# EAGLE design Titan_6L_v1p2 (EAGLE 9.6.2)
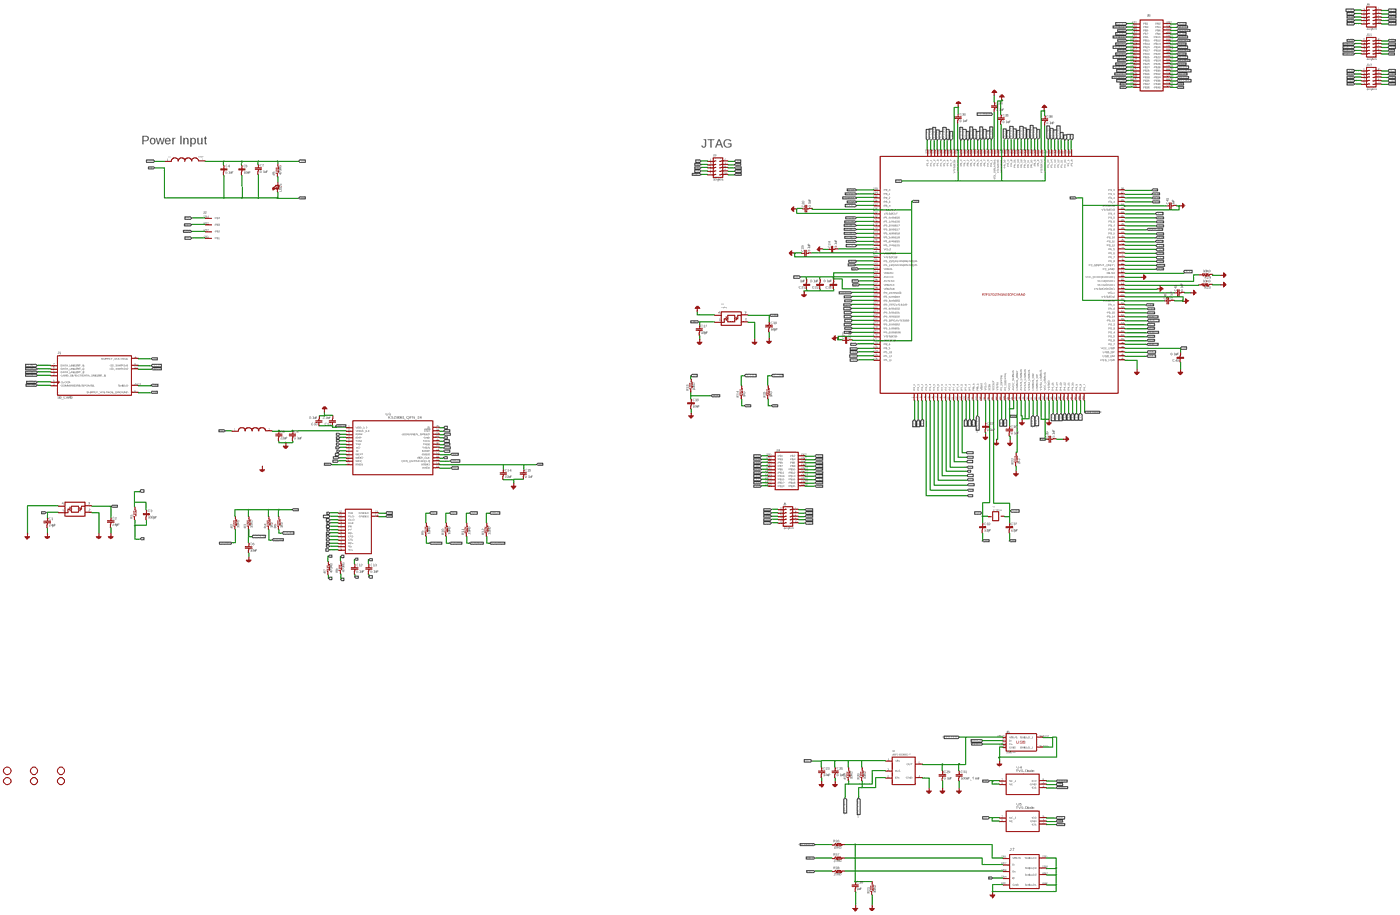
[diagram p0: schematic, sheet 1, overview]
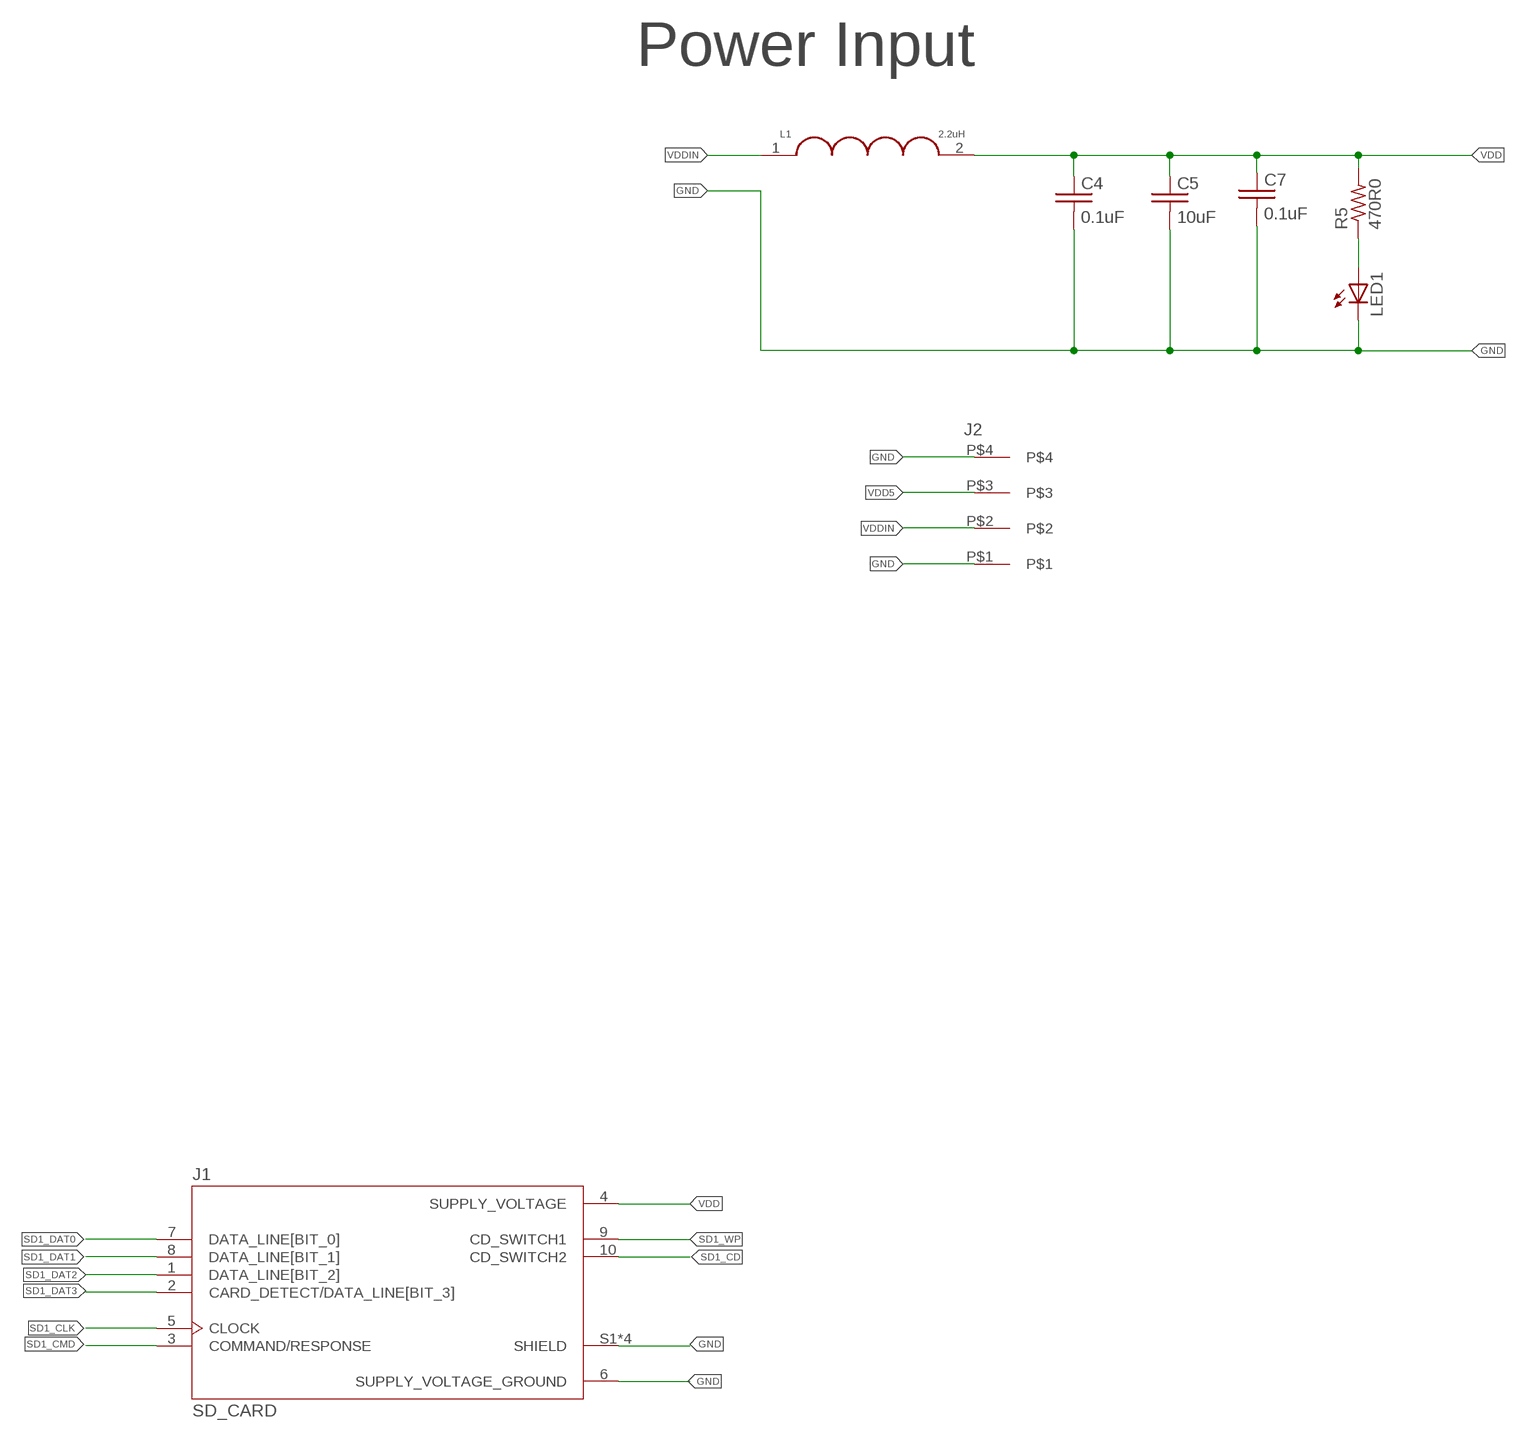
[diagram p1: schematic, sheet 1, part 1 of 5]
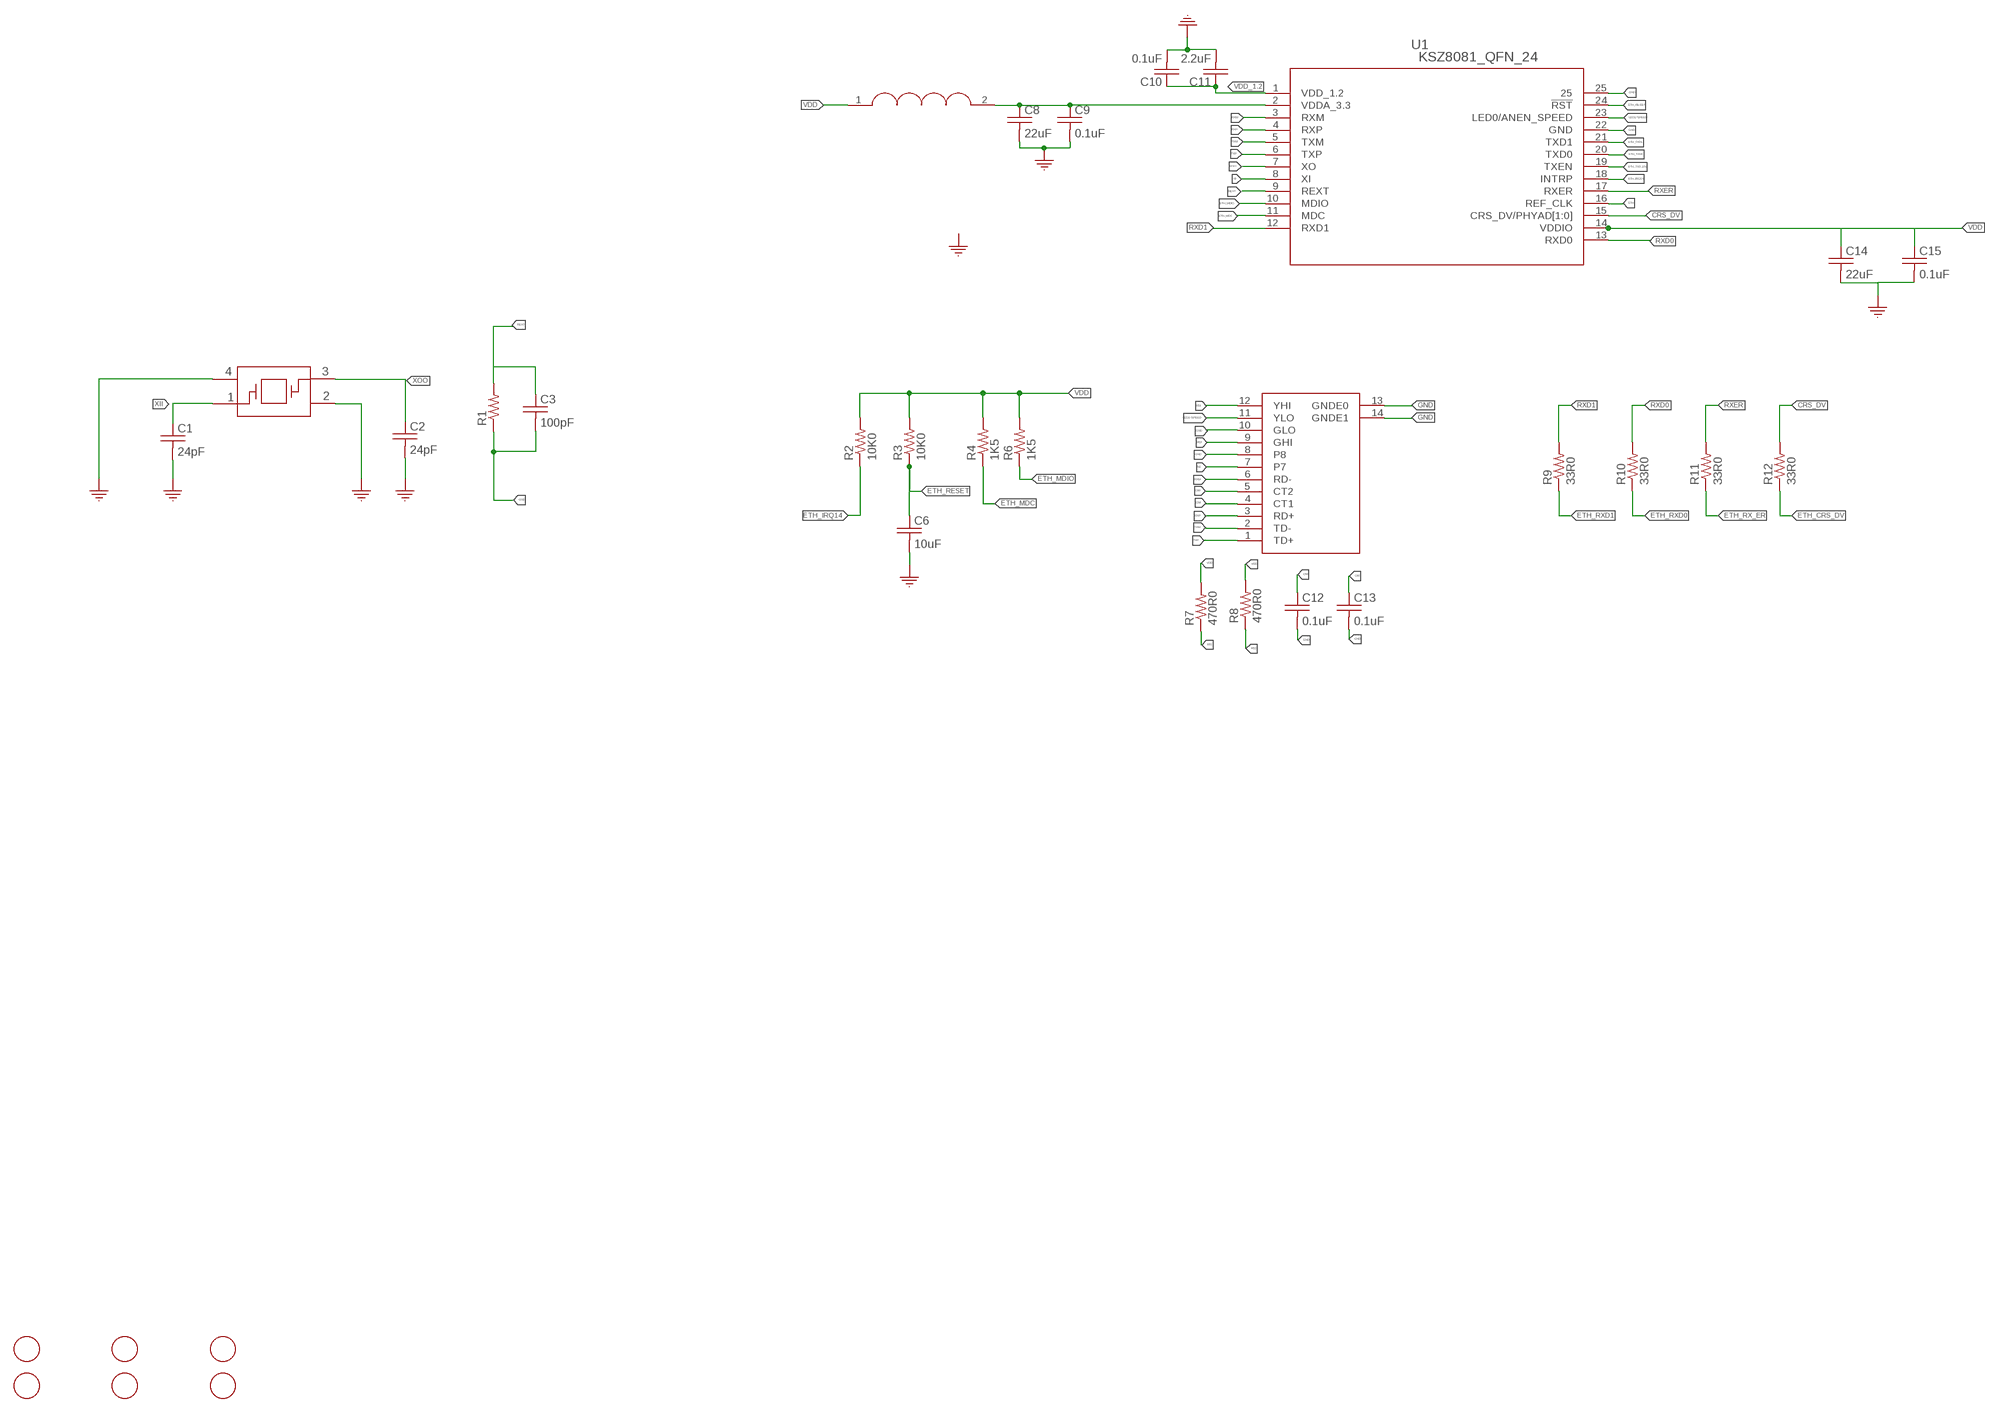
[diagram p2: schematic, sheet 1, part 2 of 5]
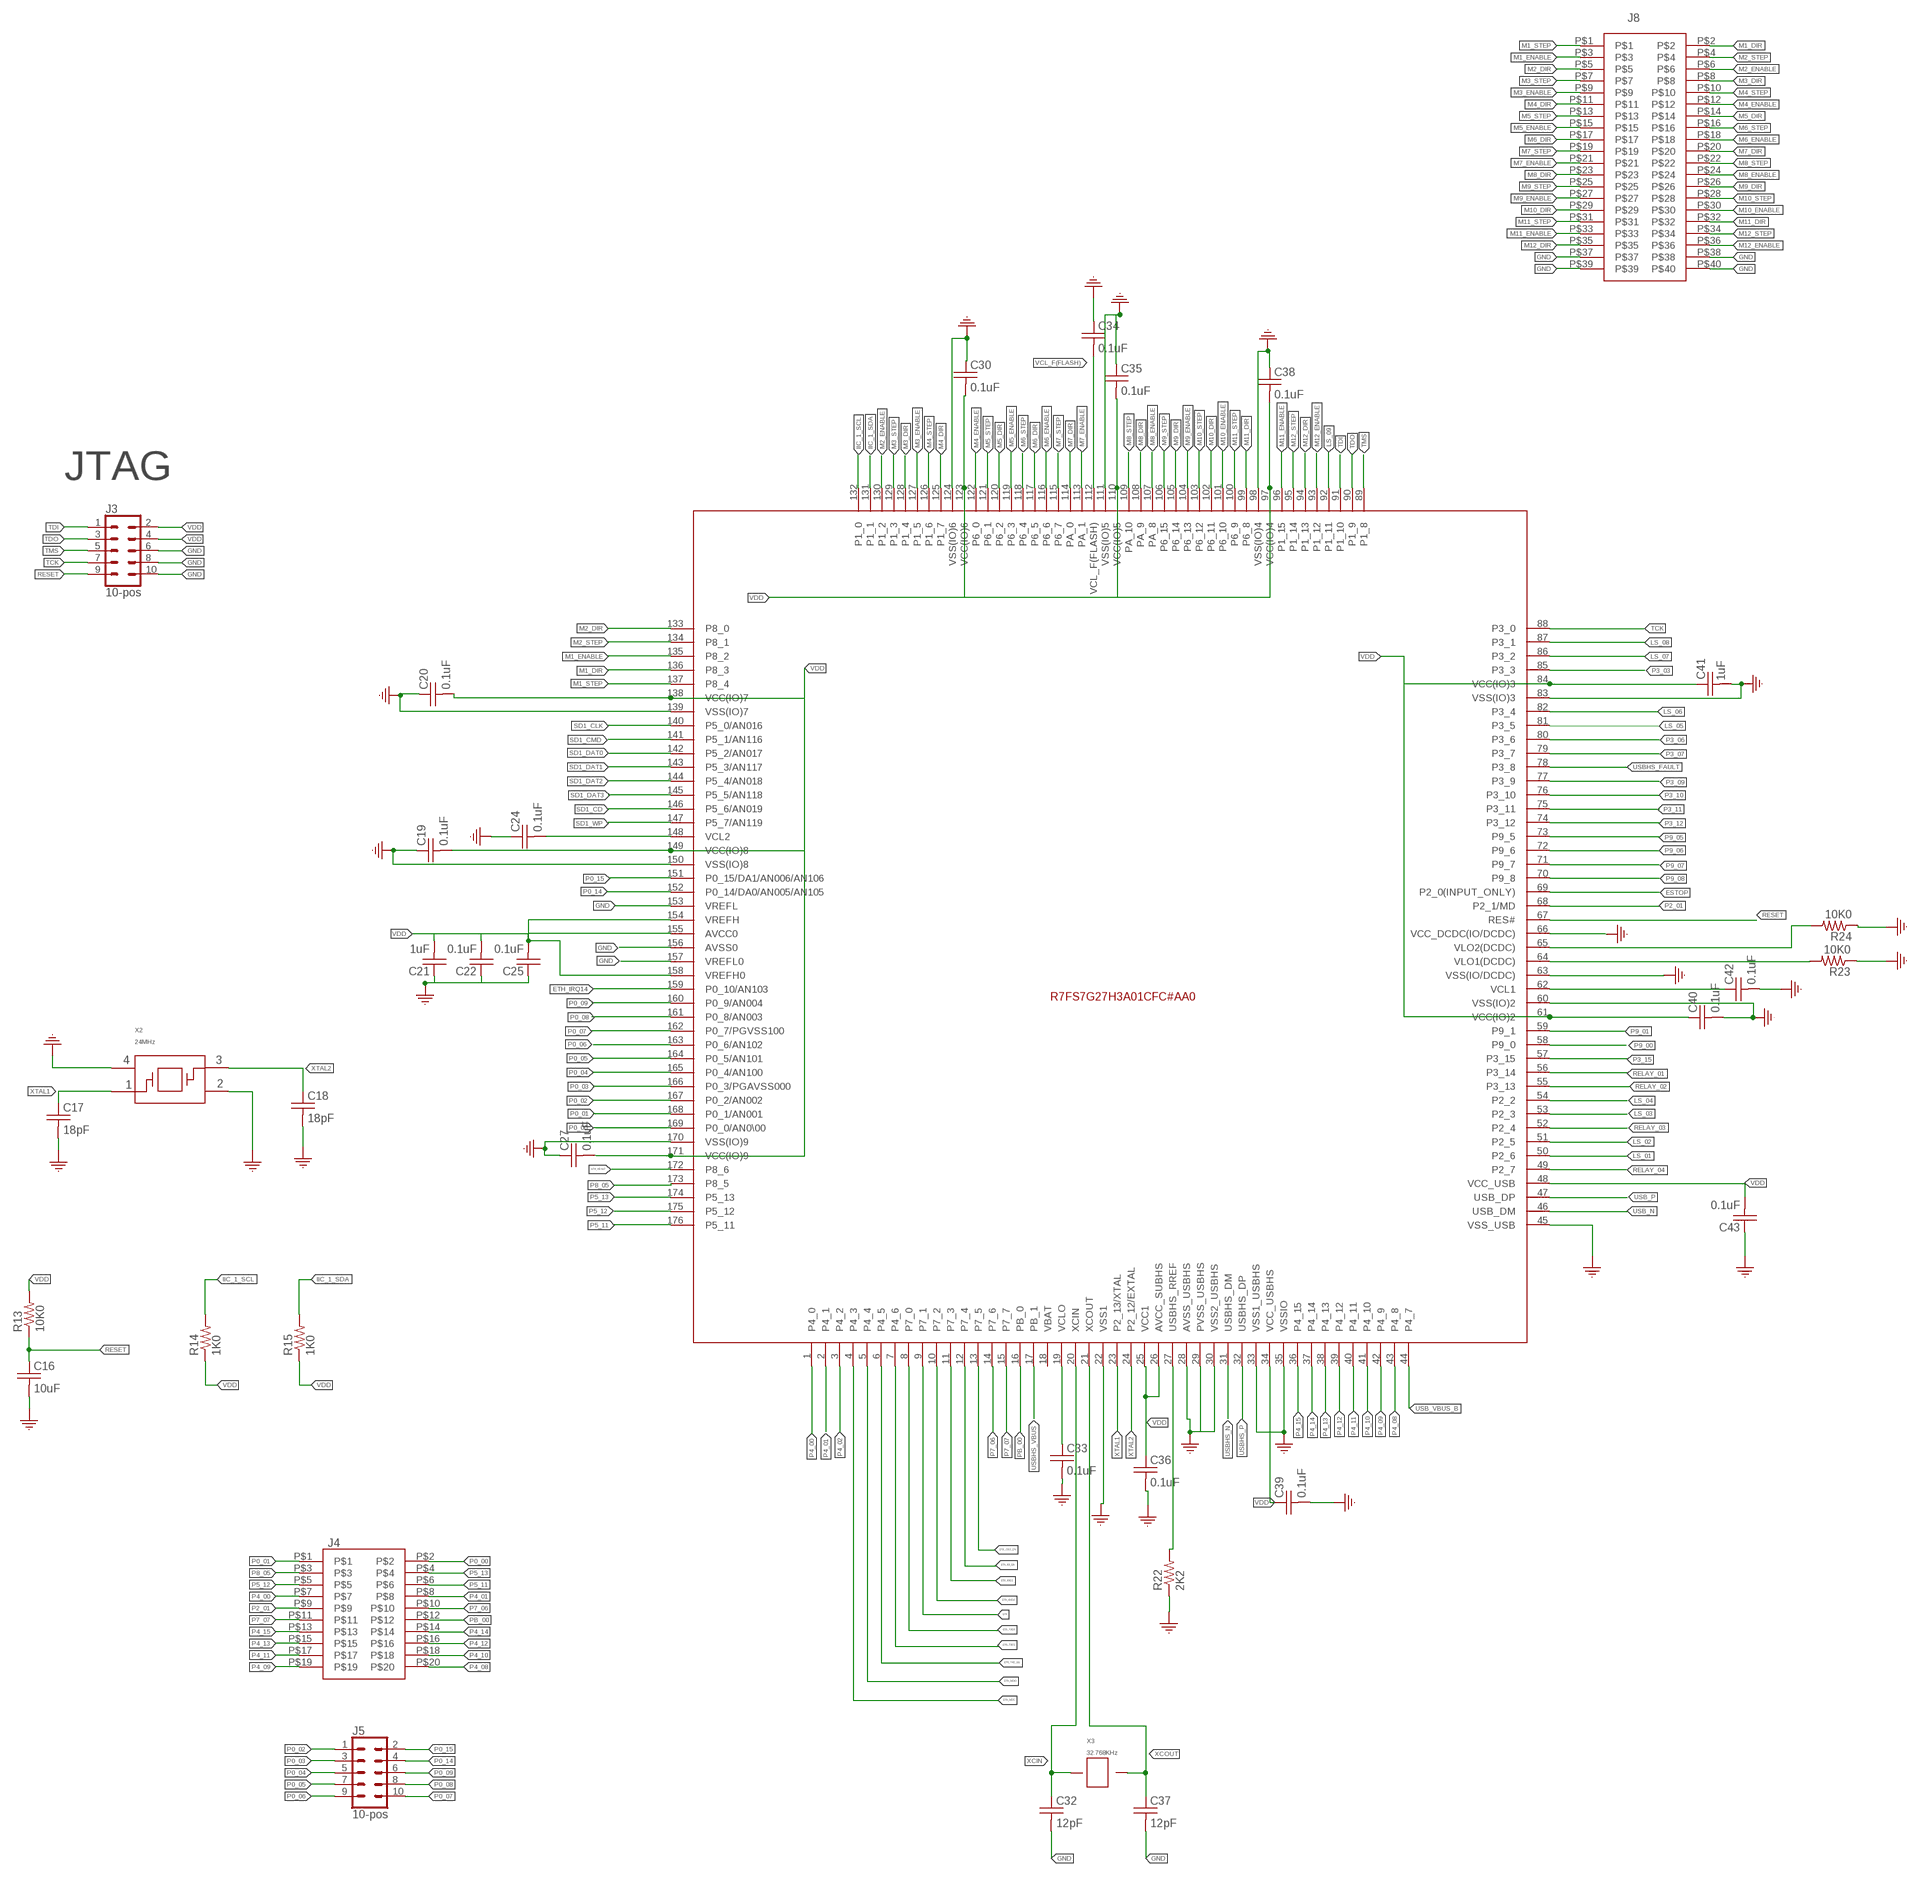
[diagram p3: schematic, sheet 1, part 3 of 5]
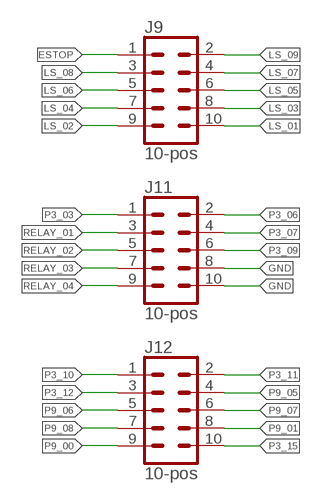
[diagram p4: schematic, sheet 1, part 4 of 5]
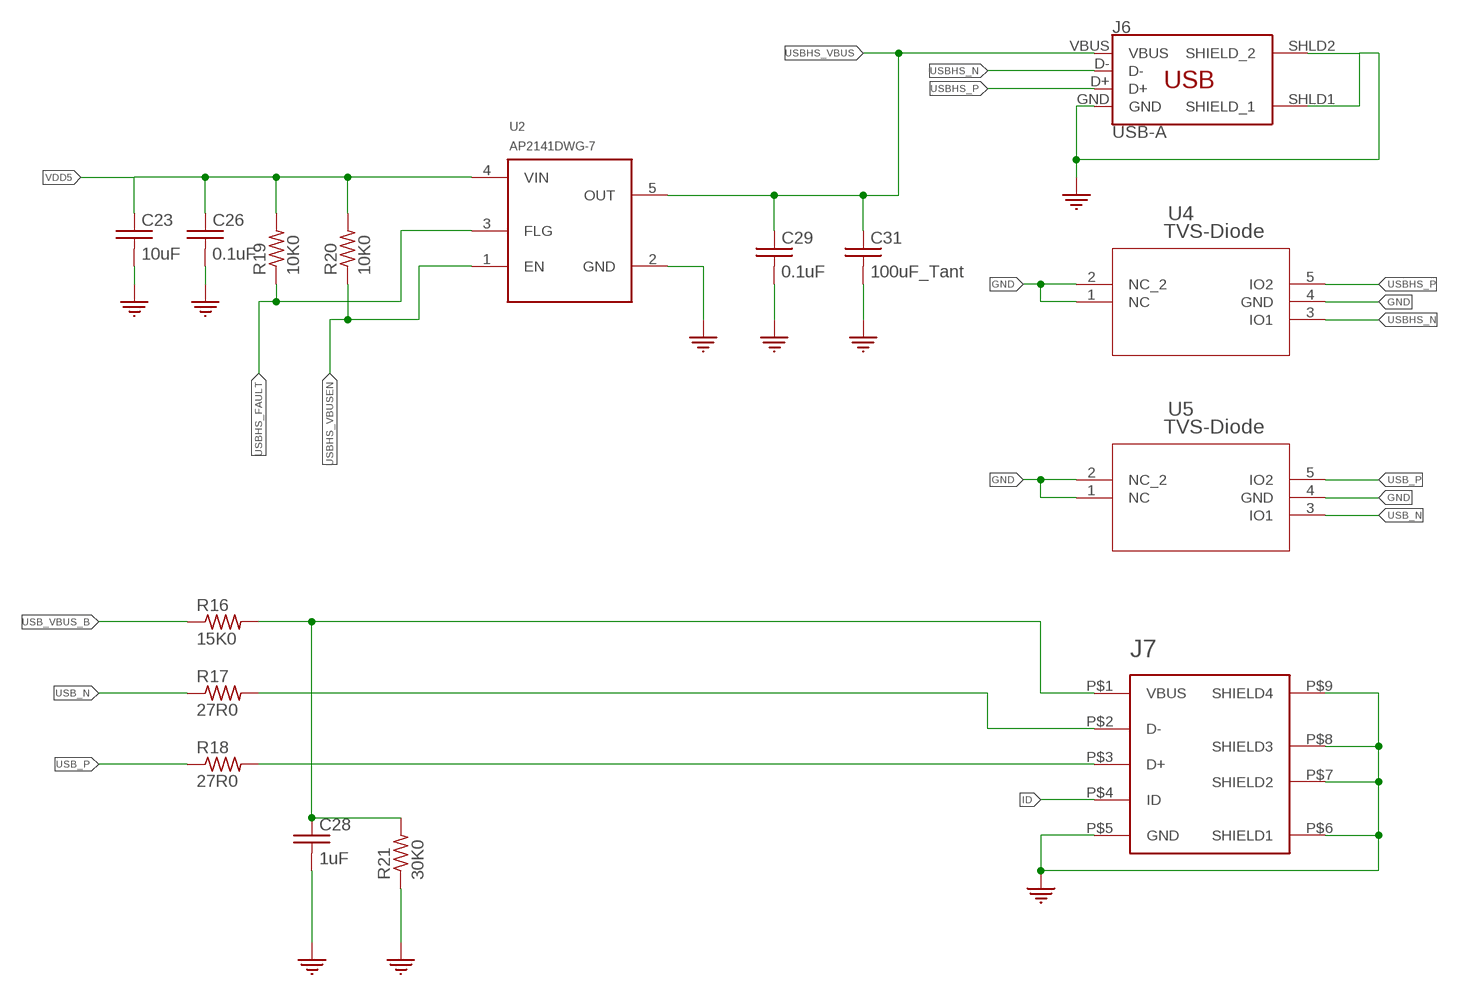
[diagram p5: schematic, sheet 1, part 5 of 5]

## Parts
AFID1  FIDUCIAL_1MM  [FIDUCIAL_1MM]
AFID2  FIDUCIAL_1MM  [FIDUCIAL_1MM]
AFID3  FIDUCIAL_1MM  [FIDUCIAL_1MM]
AFID4  FIDUCIAL_1MM  [FIDUCIAL_1MM]
AFID5  FIDUCIAL_1MM  [FIDUCIAL_1MM]
AFID6  FIDUCIAL_1MM  [FIDUCIAL_1MM]
C1  24pF  C_0402_24PF  [0402]
C2  24pF  C_0402_24PF  [0402]
C3  100pF  C_0402_100PF  [0402]
C4  0.1uF  C_0402_0.1UF  [0402]
C5  10uF  C_0402_10UF  [0402]
C6  10uF  C_0402_10UF  [0402]
C7  0.1uF  C_0402_0.1UF  [0402]
C8  22uF  C_0402_22UF  [0402]
C9  0.1uF  C_0402_0.1UF  [0402]
C10  0.1uF  C_0402_0.1UF  [0402]
C11  2.2uF  C_0402_2.2UF  [0402]
C12  0.1uF  C_0402_0.1UF  [0402]
C13  0.1uF  C_0402_0.1UF  [0402]
C14  22uF  C_0402_22UF  [0402]
C15  0.1uF  C_0402_0.1UF  [0402]
C16  10uF  C_0402_10UF  [0402]
C17  18pF  C_0402_18PF  [0402]
C18  18pF  C_0402_18PF  [0402]
C19  0.1uF  C_0402_0.1UF  [0402]
C20  0.1uF  C_0402_0.1UF  [0402]
C21  1uF  C_0402_1UF  [0402]
C22  0.1uF  C_0402_0.1UF  [0402]
C23  10uF  C_0402_10UF  [0402]
C24  0.1uF  C_0402_0.1UF  [0402]
C25  0.1uF  C_0402_0.1UF  [0402]
C26  0.1uF  C_0402_0.1UF  [0402]
C27  0.1uF  C_0402_0.1UF  [0402]
C28  1uF  C_0402_1UF  [0402]
C29  0.1uF  C_0402_0.1UF  [0402]
C30  0.1uF  C_0402_0.1UF  [0402]
C31  100uF_Tant  C_1210_100UF_TANT  [C1210]
C32  12pF  C_0402_12PF  [0402]
C33  0.1uF  C_0402_0.1UF  [0402]
C34  0.1uF  C_0402_0.1UF  [0402]
C35  0.1uF  C_0402_0.1UF  [0402]
C36  0.1uF  C_0402_0.1UF  [0402]
C37  12pF  C_0402_12PF  [0402]
C38  0.1uF  C_0402_0.1UF  [0402]
C39  0.1uF  C_0402_0.1UF  [0402]
C40  0.1uF  C_0402_0.1UF  [0402]
C41  1uF  C_0402_1UF  [0402]
C42  0.1uF  C_0402_0.1UF  [0402]
C43  0.1uF  C_0402_0.1UF  [0402]
FB1  FB2_603  FB_0603_120_OHM0603  [0603]
J1  SD_CARD  SD_CARD_1140084168  [SD_CARD]
J2  4-pos  3.81MM_1_X_4_RT_ANGLE_PLUG_HEADER  [1X4_3.81MM_PITCH]
J3  10-pos  CONN_05X2_RAPTH  [2X5]
J4  20-pos  2_X_10_HEADER_GENERIC  [2_X_10_.1_INCH]
J5  10-pos  CONN_05X2_RAPTH  [2X5]
J6  USB-A  USB_A  [USB_A_SMT]
J7  USB-B-Micro  USB_MICRO-B  [USB_MICRO-B]
J8  40-pos  HEADER_2_X_20_GENERIC  [HEADER_2_X_20_.1_INCH]
J9  10-pos  CONN_05X2_RAPTH  [2X5]
J11  10-pos  CONN_05X2_RAPTH  [2X5]
J12  10-pos  CONN_05X2_RAPTH  [2X5]
L1  2.2uH  INDUCTOR_1008_2.2_MH_1.3A  [1008]
LED1  Green  LED_0805_GREEN  [0805]
R1  6K49  R_0402_6K49  [0402]
R2  10K0  R_0402_10K0  [0402]
R3  10K0  R_0402_10K0  [0402]
R4  1K5  R_0402_1K5  [0402]
R5  470R0  R_0402_470R0  [0402]
R6  1K5  R_0402_1K5  [0402]
R7  470R0  R_0402_470R0  [0402]
R8  470R0  R_0402_470R0  [0402]
R9  33R0  R_0402_33R0  [0402]
R10  33R0  R_0402_33R0  [0402]
R11  33R0  R_0402_33R0  [0402]
R12  33R0  R_0402_33R0  [0402]
R13  10K0  R_0402_10K0  [0402]
R14  1K0  R_0402_1K0  [0402]
R15  1K0  R_0402_1K0  [0402]
R16  15K0  R_0402_15K0  [0402]
R17  27R0  R_0402_27R0  [0402]
R18  27R0  R_0402_27R0  [0402]
R19  10K0  R_0402_10K0  [0402]
R20  10K0  R_0402_10K0  [0402]
R21  30K0  R_0402_30K0  [0402]
R22  2K2  R_0402_2K2  [0402]
R23  10K0  R_0402_10K0  [0402]
R24  10K0  R_0402_10K0  [0402]
RJ1  RJ45  RJ45_WITH_ELEC  [RJ45_TH_ELEC]
U1  KSZ8081_QFN_24  KSZ8081RNACAQFN-24-M  [QFN-24-M]
U2  AP2151DWG-7  [SOT-23-5]
U3  S7G2LQFP176  RENESAS_S7G2_X_176  [LQFP176_24X24]
U4  TVS-Diode  TPD2E2U06DRLR  [DRL5]
U5  TVS-Diode  TPD2E2U06DRLR  [DRL5]
X1  25MHz  XTAL_25_MHZ  [SMD_3225]
X2  24MHz  XTAL_24_MHZ  [SMD_3225]
X3  32.768KHz  XTAL_32.768KHZ  [SMD_X_2_PADS]

## Nets
C58: C12.P$1 RJ1.4(CT1)
C60: C13.P$1 RJ1.5(CT2)
CRS_DV: R12.P$2 U1.15(CRS_DV/PHYAD[1:0])
D+: J7.P$3(D+) R18.P$2
D-: J7.P$2(D-) R17.P$2
ESTOP: J9.1 U3.69(P2_0(INPUT_ONLY))
ETH: U1.16(REF_CLK) U3.9(P7_1)
ETH_CRS_DV: R12.P$1 U3.13(P7_5)
ETH_IRQ14: R2.P$1 U1.18(INTRP) U3.159(P0_10/AN103)
ETH_MDC: R4.P$1 U1.11(MDC) U3.4(P4_3)
ETH_MDIO: R6.P$1 U1.10(MDIO) U3.5(P4_4)
ETH_RESET: C6.P$1 R3.P$1 U1.24(!RST) U3.172(P8_6)
ETH_RX_ER: R11.P$1 U3.12(P7_4)
ETH_RXD0: R10.P$1 U3.10(P7_2)
ETH_RXD1: R9.P$1 U3.11(P7_3)
ETH_TXD0: U1.20(TXD0) U3.8(P7_0)
ETH_TXD1: U1.21(TXD1) U3.7(P4_6)
ETH_TXD_EN: U1.19(TXEN) U3.6(P4_5)
GND: C1.P$2 C2.P$2 C3.P$2 C4.P$2 C5.P$2 C6.P$2 C7.P$2 C8.P$2 C9.P$2 C10.P$2 C11.P$2 C12.P$2 C13.P$2 C14.P$2 C15.P$2 C16.P$2 C17.P$2 C18.P$2 C19.P$1 C20.P$1 C21.P$1 C22.P$1 C23.P$2 C24.P$1 C25.P$1 C26.P$2 C27.P$1 C28.P$2 C29.P$2 C30.P$1 C31.2 C32.P$2 C33.P$2 C34.P$1 C35.P$1 C36.P$2 C37.P$2 C38.P$1 C39.P$2 C40.P$2 C41.P$2 C42.P$2 C43.P$1 J1.6(SUPPLY_VOLTAGE_GROUND) J1.S1(SHIELD) J1.S2(SHIELD) J1.S3(SHIELD) J1.S4(SHIELD) J2.P$1 J2.P$4 J3.6 J3.8 J3.10 J6.GND J6.SHLD1(SHIELD_1) J6.SHLD2(SHIELD_2) J7.P$5(GND) J7.P$6(SHIELD1) J7.P$7(SHIELD2) J7.P$8(SHIELD3) J7.P$9(SHIELD4) J8.P$37 J8.P$38 J8.P$39 J8.P$40 J11.8 J11.10 LED1.2(C) R1.P$1 R21.P$1 R22.P$1 R23.P$1 R24.P$1 RJ1.8 RJ1.10(GLO) RJ1.13(GNDE0) RJ1.14(GNDE1) U1.22(GND) U1.25 U2.2(GND) U3.22(VSS1) U3.28(AVSS_USBHS) U3.29(PVSS_USBHS) U3.30(VSS2_USBHS) U3.33(VSS1_USBHS) U3.35(VSSIO) U3.45(VSS_USB) U3.60(VSS(IO)2) U3.63(VSS(IO/DCDC)) U3.66(VCC_DCDC(IO/DCDC)) U3.83(VSS(IO)3) U3.98(VSS(IO)4) U3.111(VSS(IO)5) U3.124(VSS(IO)6) U3.139(VSS(IO)7) U3.150(VSS(IO)8) U3.153(VREFL) U3.156(AVSS0) U3.157(VREFL0) U3.170(VSS(IO)9) U4.1(NC) U4.2(NC_2) U4.4(GND) U5.1(NC) U5.2(NC_2) U5.4(GND) X1.2 X1.4 X2.2 X2.4
ID: J7.P$4(ID)
IIC_1_SCL: R14.P$2 U3.132(P1_0)
IIC_1_SDA: R15.P$2 U3.131(P1_1)
LED1/SPEED: RJ1.11(YLO) U1.23(LED0/ANEN_SPEED)
LS_01: J9.10 U3.50(P2_6)
LS_02: J9.9 U3.51(P2_5)
LS_03: J9.8 U3.53(P2_3)
LS_04: J9.7 U3.54(P2_2)
LS_05: J9.6 U3.81(P3_5)
LS_06: J9.5 U3.82(P3_4)
LS_07: J9.4 U3.86(P3_2)
LS_08: J9.3 U3.87(P3_1)
LS_09: J9.2 U3.92(P1_11)
M1_DIR: J8.P$2 U3.136(P8_3)
M1_ENABLE: J8.P$3 U3.135(P8_2)
M1_STEP: J8.P$1 U3.137(P8_4)
M2_DIR: J8.P$5 U3.133(P8_0)
M2_ENABLE: J8.P$6 U3.130(P1_2)
M2_STEP: J8.P$4 U3.134(P8_1)
M3_DIR: J8.P$8 U3.128(P1_4)
M3_ENABLE: J8.P$9 U3.127(P1_5)
M3_STEP: J8.P$7 U3.129(P1_3)
M4_DIR: J8.P$11 U3.125(P1_7)
M4_ENABLE: J8.P$12 U3.122(P6_0)
M4_STEP: J8.P$10 U3.126(P1_6)
M5_DIR: J8.P$14 U3.120(P6_2)
M5_ENABLE: J8.P$15 U3.119(P6_3)
M5_STEP: J8.P$13 U3.121(P6_1)
M6_DIR: J8.P$17 U3.117(P6_5)
M6_ENABLE: J8.P$18 U3.116(P6_6)
M6_STEP: J8.P$16 U3.118(P6_4)
M7_DIR: J8.P$20 U3.114(PA_0)
M7_ENABLE: J8.P$21 U3.113(PA_1)
M7_STEP: J8.P$19 U3.115(P6_7)
M8_DIR: J8.P$23 U3.108(PA_9)
M8_ENABLE: J8.P$24 U3.107(PA_8)
M8_STEP: J8.P$22 U3.109(PA_10)
M9_DIR: J8.P$26 U3.105(P6_14)
M9_ENABLE: J8.P$27 U3.104(P6_13)
M9_STEP: J8.P$25 U3.106(P6_15)
M10_DIR: J8.P$29 U3.102(P6_11)
M10_ENABLE: J8.P$30 U3.101(P6_10)
M10_STEP: J8.P$28 U3.103(P6_12)
M11_DIR: J8.P$32 U3.99(P6_8)
M11_ENABLE: J8.P$33 U3.96(P1_15)
M11_STEP: J8.P$31 U3.100(P6_9)
M12_DIR: J8.P$35 U3.94(P1_13)
M12_ENABLE: J8.P$36 U3.93(P1_12)
M12_STEP: J8.P$34 U3.95(P1_14)
N$1: C24.P$2 U3.148(VCL2)
N$3: LED1.1(A) R5.P$1
N$4: C33.P$1 U3.19(VCLO)
N$5: C42.P$1 U3.62(VCL1)
N$6: R23.P$2 U3.64(VLO1(DCDC))
N$7: R24.P$2 U3.65(VLO2(DCDC))
N$8: R22.P$2 U3.27(USBHS_RREF)
NC: RJ1.7
P0_00: J4.P$2 U3.169(P0_0/AN0\00)
P0_01: J4.P$1 U3.168(P0_1/AN001)
P0_02: J5.1 U3.167(P0_2/AN002)
P0_03: J5.3 U3.166(P0_3/PGAVSS000)
P0_04: J5.5 U3.165(P0_4/AN100)
P0_05: J5.7 U3.164(P0_5/AN101)
P0_06: J5.9 U3.163(P0_6/AN102)
P0_07: J5.10 U3.162(P0_7/PGVSS100)
P0_08: J5.8 U3.161(P0_8/AN003)
P0_09: J5.6 U3.160(P0_9/AN004)
P0_14: J5.4 U3.152(P0_14/DA0/AN005/AN105)
P0_15: J5.2 U3.151(P0_15/DA1/AN006/AN106)
P2_01: J4.P$9 U3.68(P2_1/MD)
P3_03: J11.1 U3.85(P3_3)
P3_06: J11.2 U3.80(P3_6)
P3_07: J11.4 U3.79(P3_7)
P3_09: J11.6 U3.77(P3_9)
P3_10: J12.1 U3.76(P3_10)
P3_11: J12.2 U3.75(P3_11)
P3_12: J12.3 U3.74(P3_12)
P3_15: J12.10 U3.57(P3_15)
P4_00: J4.P$7 U3.1(P4_0)
P4_01: J4.P$8 U3.2(P4_1)
P4_02: U3.3(P4_2)
P4_08: J4.P$20 U3.43(P4_8)
P4_09: J4.P$19 U3.42(P4_9)
P4_10: J4.P$18 U3.41(P4_10)
P4_11: J4.P$17 U3.40(P4_11)
P4_12: J4.P$16 U3.39(P4_12)
P4_13: J4.P$15 U3.38(P4_13)
P4_14: J4.P$14 U3.37(P4_14)
P4_15: J4.P$13 U3.36(P4_15)
P5_11: J4.P$6 U3.176(P5_11)
P5_12: J4.P$5 U3.175(P5_12)
P5_13: J4.P$4 U3.174(P5_13)
P7_06: J4.P$10 U3.14(P7_6)
P7_07: J4.P$11 U3.15(P7_7)
P8_05: J4.P$3 U3.173(P8_5)
P9_00: J12.9 U3.58(P9_0)
P9_01: J12.8 U3.59(P9_1)
P9_05: J12.4 U3.73(P9_5)
P9_06: J12.5 U3.72(P9_6)
P9_07: J12.6 U3.71(P9_7)
P9_08: J12.7 U3.70(P9_8)
PB_00: J4.P$12 U3.16(PB_0)
R51: R7.P$1 RJ1.12(YHI)
R52: R8.P$1 RJ1.9(GHI)
RELAY_01: J11.3 U3.56(P3_14)
RELAY_02: J11.5 U3.55(P3_13)
RELAY_03: J11.7 U3.52(P2_4)
RELAY_04: J11.9 U3.49(P2_7)
RESET: C16.P$1 J3.9 R13.P$1 U3.67(RES#)
REXT: C3.P$1 R1.P$2 U1.9(REXT)
RXD0: R10.P$2 U1.13(RXD0)
RXD1: R9.P$2 U1.12(RXD1)
RXER: R11.P$2 U1.17(RXER)
RXM: RJ1.6(RD-) U1.3(RXM)
RXP: RJ1.3(RD+) U1.4(RXP)
SD1_CD: J1.10(CD_SWITCH2) U3.146(P5_6/AN019)
SD1_CLK: J1.5(CLOCK) U3.140(P5_0/AN016)
SD1_CMD: J1.3(COMMAND/RESPONSE) U3.141(P5_1/AN116)
SD1_DAT0: J1.7(DATA_LINE[BIT_0]) U3.142(P5_2/AN017)
SD1_DAT1: J1.8(DATA_LINE[BIT_1]) U3.143(P5_3/AN117)
SD1_DAT2: J1.1(DATA_LINE[BIT_2]) U3.144(P5_4/AN018)
SD1_DAT3: J1.2(CARD_DETECT/DATA_LINE[BIT_3]) U3.145(P5_5/AN118)
SD1_WP: J1.9(CD_SWITCH1) U3.147(P5_7/AN119)
TCK: J3.7 U3.88(P3_0)
TDI: J3.1 U3.91(P1_10)
TDO: J3.3 U3.90(P1_9)
TMS: J3.5 U3.89(P1_8)
TXM: RJ1.2(TD-) U1.5(TXM)
TXP: RJ1.1(TD+) U1.6(TXP)
USB_N: R17.P$1 U3.46(USB_DM) U5.3(IO1)
USB_P: R18.P$1 U3.47(USB_DP) U5.5(IO2)
USB_VBUS_B: R16.P$1 U3.44(P4_7)
USBHS_FAULT: R19.P$1 U2.3(FLG) U3.78(P3_8)
USBHS_N: J6.D- U3.31(USBHS_DM) U4.3(IO1)
USBHS_P: J6.D+ U3.32(USBHS_DP) U4.5(IO2)
USBHS_VBUS: C29.P$1 C31.1 J6.VBUS U2.5(OUT) U3.17(PB_1)
USBHS_VBUSEN: R20.P$1 U2.1(EN)
VBUS: C28.P$1 J7.P$1(VBUS) R16.P$2 R21.P$2
VCL_F(FLASH): C34.P$2 U3.112(VCL_F(FLASH))
VDD: C4.P$1 C5.P$1 C7.P$1 C14.P$1 C15.P$1 C19.P$2 C20.P$2 C21.P$2 C22.P$2 C25.P$2 C27.P$2 C30.P$2 C35.P$2 C36.P$1 C38.P$2 C39.P$1 C40.P$1 C41.P$1 C43.P$2 FB1.1 J1.4(SUPPLY_VOLTAGE) J3.2 J3.4 L1.2 R2.P$2 R3.P$2 R4.P$2 R5.P$2 R6.P$2 R7.P$2 R8.P$2 R13.P$2 R14.P$1 R15.P$1 U1.14(VDDIO) U3.25(VCC1) U3.26(AVCC_SUBHS) U3.34(VCC_USBHS) U3.48(VCC_USB) U3.61(VCC(IO)2) U3.84(VCC(IO)3) U3.97(VCC(IO)4) U3.110(VCC(IO)5) U3.123(VCC(IO)6) U3.138(VCC(IO)7) U3.149(VCC(IO)8) U3.154(VREFH) U3.155(AVCC0) U3.158(VREFH0) U3.171(VCC(IO)9)
VDD5: C23.P$1 C26.P$1 J2.P$3 R19.P$2 R20.P$2 U2.4(VIN)
VDD_1.2: C10.P$1 C11.P$1 U1.1(VDD_1.2)
VDD_ENET1: C8.P$1 C9.P$1 FB1.2 U1.2(VDDA_3.3)
VDDIN: J2.P$2 L1.1
XCIN: C32.P$1 U3.20(XCIN) X3.P$1
XCOUT: C37.P$1 U3.21(XCOUT) X3.P$2
XII: C1.P$1 U1.8(XI) X1.1
XOO: C2.P$1 U1.7(XO) X1.3
XTAL1: C17.P$1 U3.23(P2_13/XTAL) X2.1
XTAL2: C18.P$1 U3.24(P2_12/EXTAL) X2.3
Unconnected: U3.18(VBAT)

## Notes on the sheet
- Power Input | JTAG

## Library data of the parts
AFID1-AFID6 = 3D_MIG_Controller:FIDUCIAL_1MM: For use by pick and place machines to calibrate the vision/machine, 1mm By microbuilder.eu
C1 C2 = 3D_MIG_Controller:C_0402_24PF; PARTNO: CC0402GRNPO9BN240
C3 = 3D_MIG_Controller:C_0402_100PF; PARTNO: CL05C101JB5NNNC
C4 C7 C9 C10 C12 C13 C15 C19 C20 C22 C24-C27 C29 C30 C33-C36 C38-C40 C42 C43 = 3D_MIG_Controller:C_0402_0.1UF; PARTNO: CL05F104ZO5NNNC
C5 C6 C16 C23 = 3D_MIG_Controller:C_0402_10UF; PARTNO: CL05A106MP8NUB8
C8 C14 = 3D_MIG_Controller:C_0402_22UF; PARTNO: CL05A226MQ5N6J8
C11 = 3D_MIG_Controller:C_0402_2.2UF; PARTNO: GRM155C81C225ME15D
C17 C18 = 3D_MIG_Controller:C_0402_18PF; PARTNO: UMK105CG180JV-F
C21 C28 C41 = 3D_MIG_Controller:C_0402_1UF; PARTNO: CL05A105KO5NNNC
C31 = 3D_MIG_Controller:C_1210_100UF_TANT; PARTNO: TLJT107M010R0900
C32 C37 = 3D_MIG_Controller:C_0402_12PF; PARTNO: CL05C120JB5NNNC
FB1 = 3D_MIG_Controller:FB_0603_120_OHM; PARTNO: BLM18PG121SN1D
J1 = 3D_MIG_Controller:SD_CARD_1140084168: Conn; IC Socket; Micro SD; Right Angle; PCB Mount; MicroSD Ser.:: 10 _8 + 2_ Position Card Connector Secure Digital - microSD™ Surface Mount, Right Angle Gold; MF: Amphenol ICC; PARTNO: 114-00841-68; VID: Digikey; VP: 114-00841-68-1-ND; VURL: https://www.digikey.ae/product-detail/en/amphenol-icc-commercial-products/114-00841-68/114-00841-68-1-ND/2187101?utm_source=snapeda&utm_medium=aggregator&utm_campaign=symbol
J2 = 3D_MIG_Controller:3.81MM_1_X_4_RT_ANGLE_PLUG_HEADER: 4 Position Terminal Block Header, Male Pins, Shrouded (4 Side) 0.150" (3.81mm) 90°, Right Angle - Through Hole; PARTNO: 691322310004
J3 J5 J9 J11 J12 = 3D_MIG_Controller:CONN_05X2_RA: Connector Header Through Hole, Right Angle 10 position 0.100" (2.54mm); PARTNO: PH2RA-10-UA
J4 = 3D_MIG_Controller:2_X_10_HEADER_GENERIC: CONN HEADER R/A 20POS 2.54MM, Straight, Right Angle; PARTNO: 67996-420HLF
J6 = 3D_MIG_Controller:USB_A: USB-A Connector Male and female variants, as well as PTH and SMT variants SparkFun Products: SparkFun XBee Explorer Dongle <https://www.sparkfun.com/products/11697> PTH Male SparkFun MicroView-USB Programmer <https://www.sparkfun.com/products/12924> SMT Male SparkFun USB Type A Female Breakout <https://www.sparkfun.com/products/12700> SMT Female; NOZZLE: CN400; PARTNO: 87583-3010RPALF
J7 = 3D_MIG_Controller:USB_MICRO-B; PARTNO: 10118192-0002LF
J8 = 3D_MIG_Controller:HEADER_2_X_20_GENERIC: CONN HEADER R/A 40POS 2.54MM; PARTNO: 61304021021
L1 = 3D_MIG_Controller:INDUCTOR_1008_2.2_MH_1.3A; PARTNO: LQM2HPN2R2MG0L
LED1 = 3D_MIG_Controller:LED_0805_GREEN: Green 570nm LED Indication - Discrete 2.2V 0805 (2012 Metric); PARTNO: LG R971-KN-1
R1 = 3D_MIG_Controller:R_0402_6K49; PARTNO: RMCF0402FT6K49
R2 R3 R13 R19 R20 R23 R24 = 3D_MIG_Controller:R_0402_10K0; PARTNO: RMCF0402JT10K0
R4 R6 = 3D_MIG_Controller:R_0402_1K5; PARTNO: RMCF0402JT1K50
R5 R7 R8 = 3D_MIG_Controller:R_0402_470R0; PARTNO: RMCF0402JT470R
R9-R12 = 3D_MIG_Controller:R_0402_33R0; PARTNO: RMCF0402JT33R0
R14 R15 = 3D_MIG_Controller:R_0402_1K0; PARTNO: CRG0402J1K0
R16 = 3D_MIG_Controller:R_0402_15K0; PARTNO: RMCF0402JT15K0
R17 R18 = 3D_MIG_Controller:R_0402_27R0; PARTNO: RMCF0402JT27R0
R21 = 3D_MIG_Controller:R_0402_30K0; PARTNO: RC0402JR-0730KL
R22 = 3D_MIG_Controller:R_0402_2K2; PARTNO: RMCF0402JT2K20
RJ1 = 3D_MIG_Controller:RJ45_WITH_ELEC; MAN: Shanghai YDS Tech; PARTNO: 13F-64GYD2PL2NL; VENDOR: lcsc.com
U1 = 3D_MIG_Controller:KSZ8081RNACA; PARTNO: KSZ8081RNACA; VENDOR: Micrel
U2 = 3D_MIG_Controller:AP2151DWG-7: Power Switch/Driver 1:1 P-Channel 500mA SOT-25; PARTNO: AP2151WG-7
U3 = 3D_MIG_Controller:RENESAS_S7G2_X_176; PARTNO: R7FS7G27H3A01CFC#AA0
U4 U5 = 3D_MIG_Controller:TPD2E2U06DRLR: TVS DIODE 5.5V 12.4V SOT5; PARTNO: TPD2E2U06DRLR
X1 = 3D_MIG_Controller:XTAL_25_MHZ; PARTNO: FA-238 25.0000MB-B3
X2 = 3D_MIG_Controller:XTAL_24_MHZ; PARTNO: FA-238 24.0000MB-C3
X3 = 3D_MIG_Controller:XTAL_32.768KHZ; PARTNO: ABS07-32.768KHZ-T

## Board
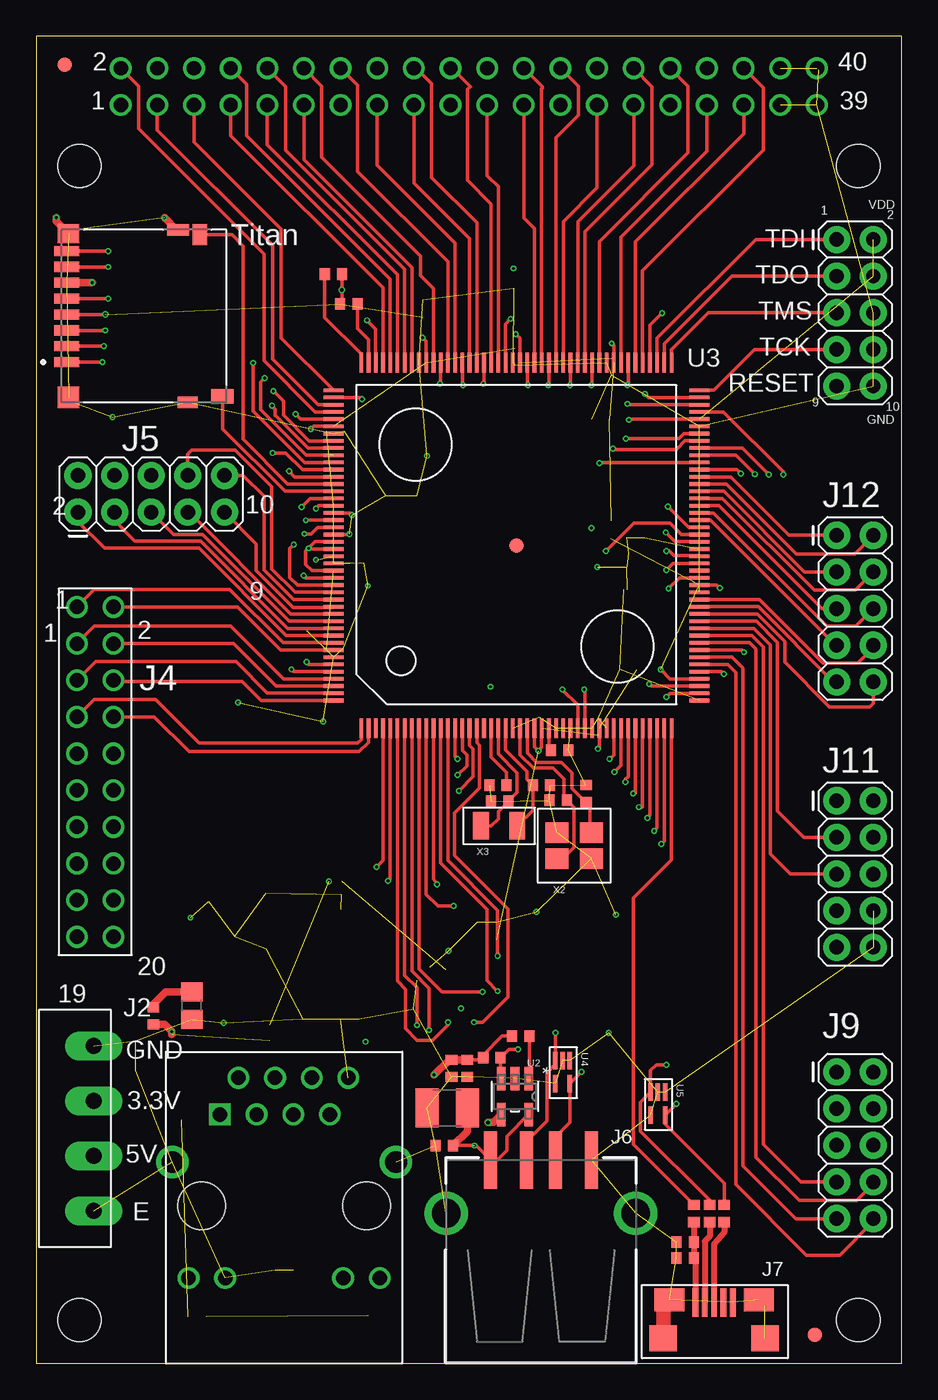
[diagram p6: board, top side]
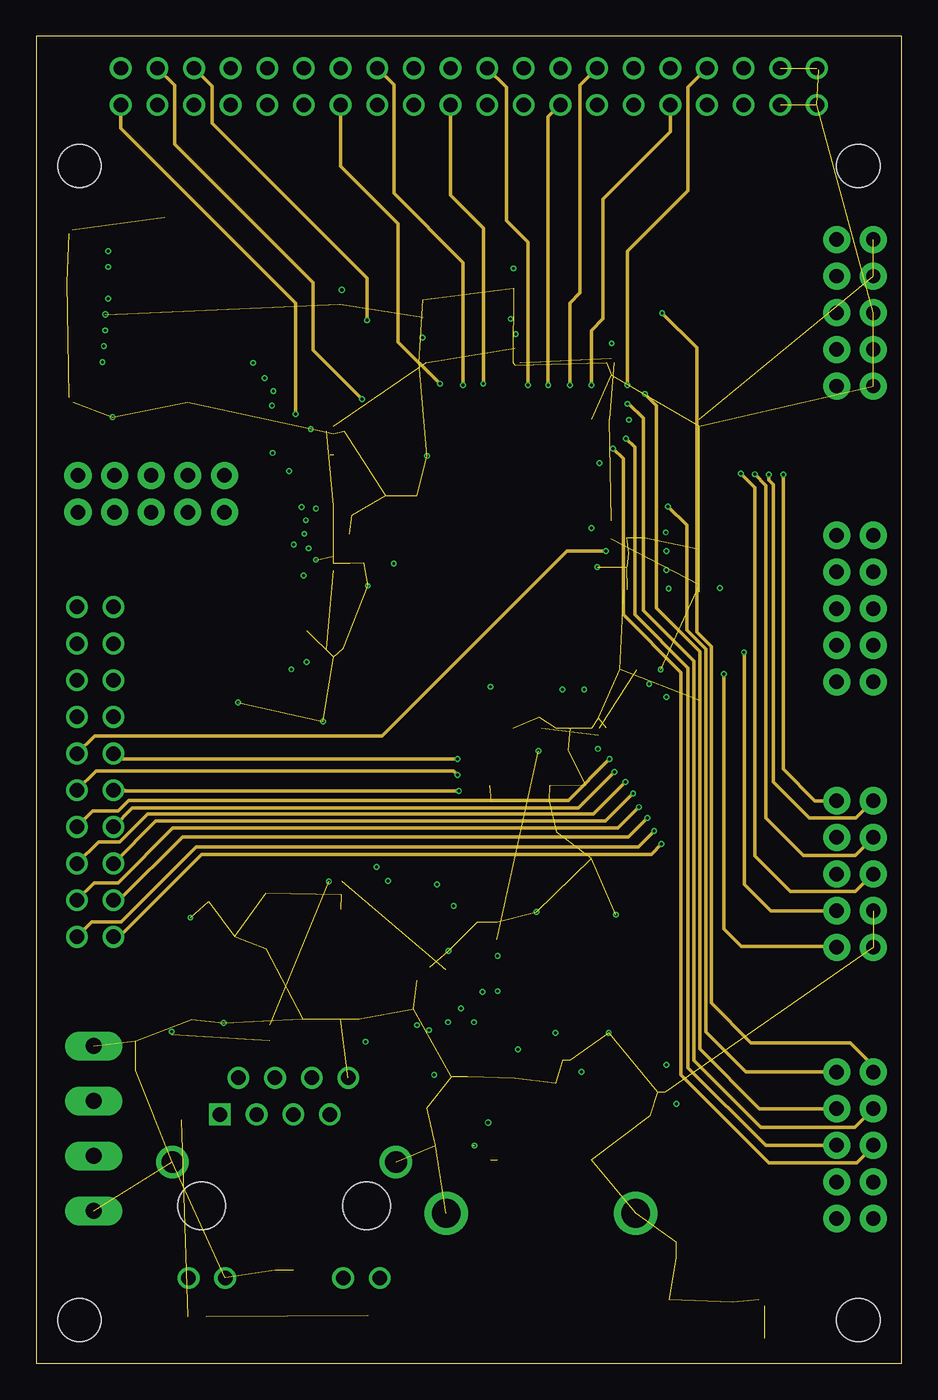
[diagram p7: board, inner layer Route3]
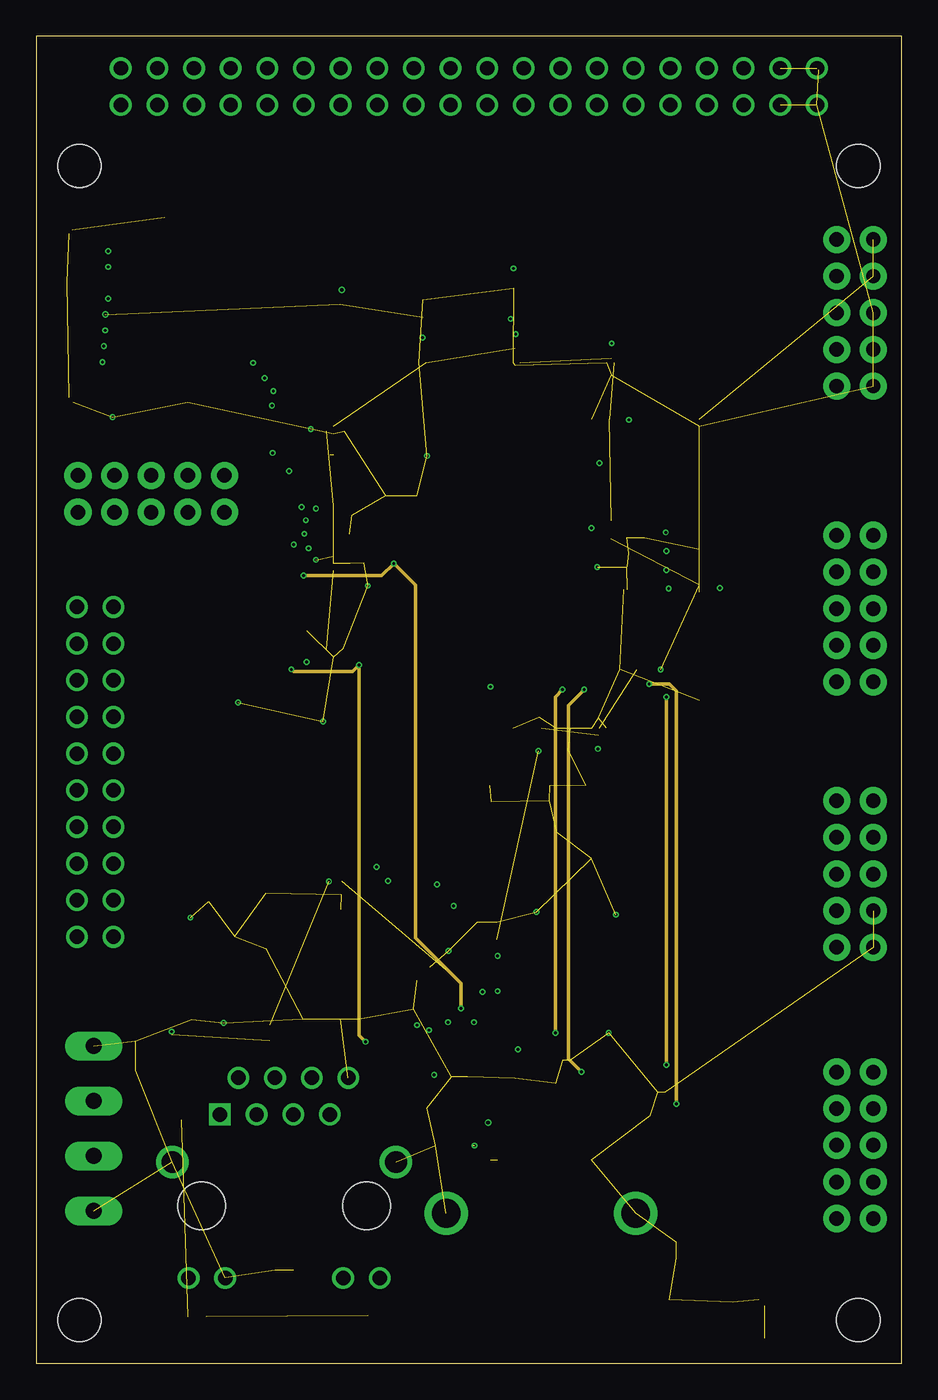
[diagram p8: board, inner layer Route14]
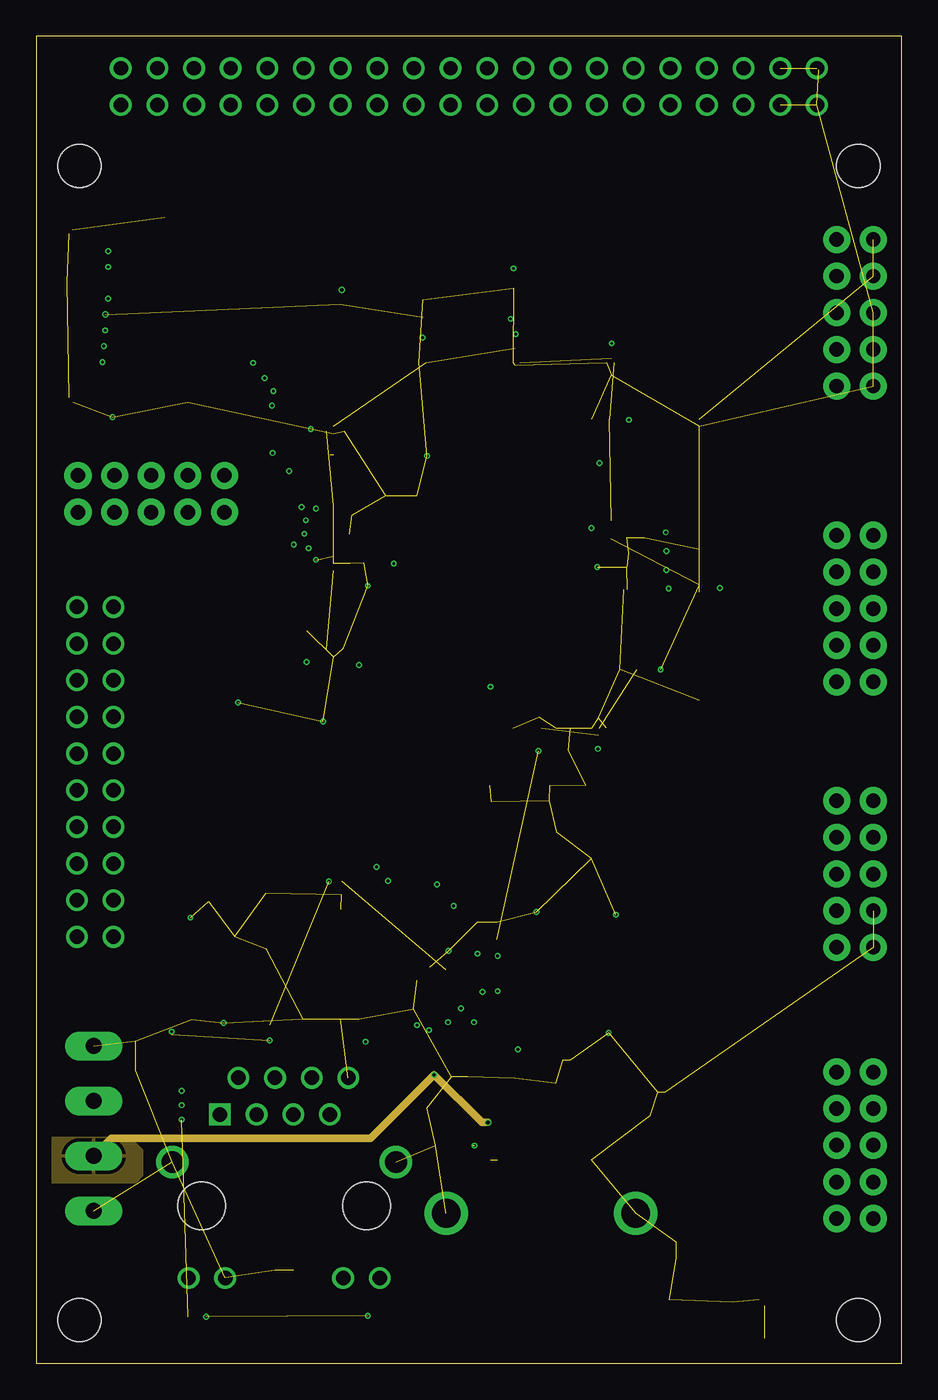
[diagram p9: board, inner layer VDD]
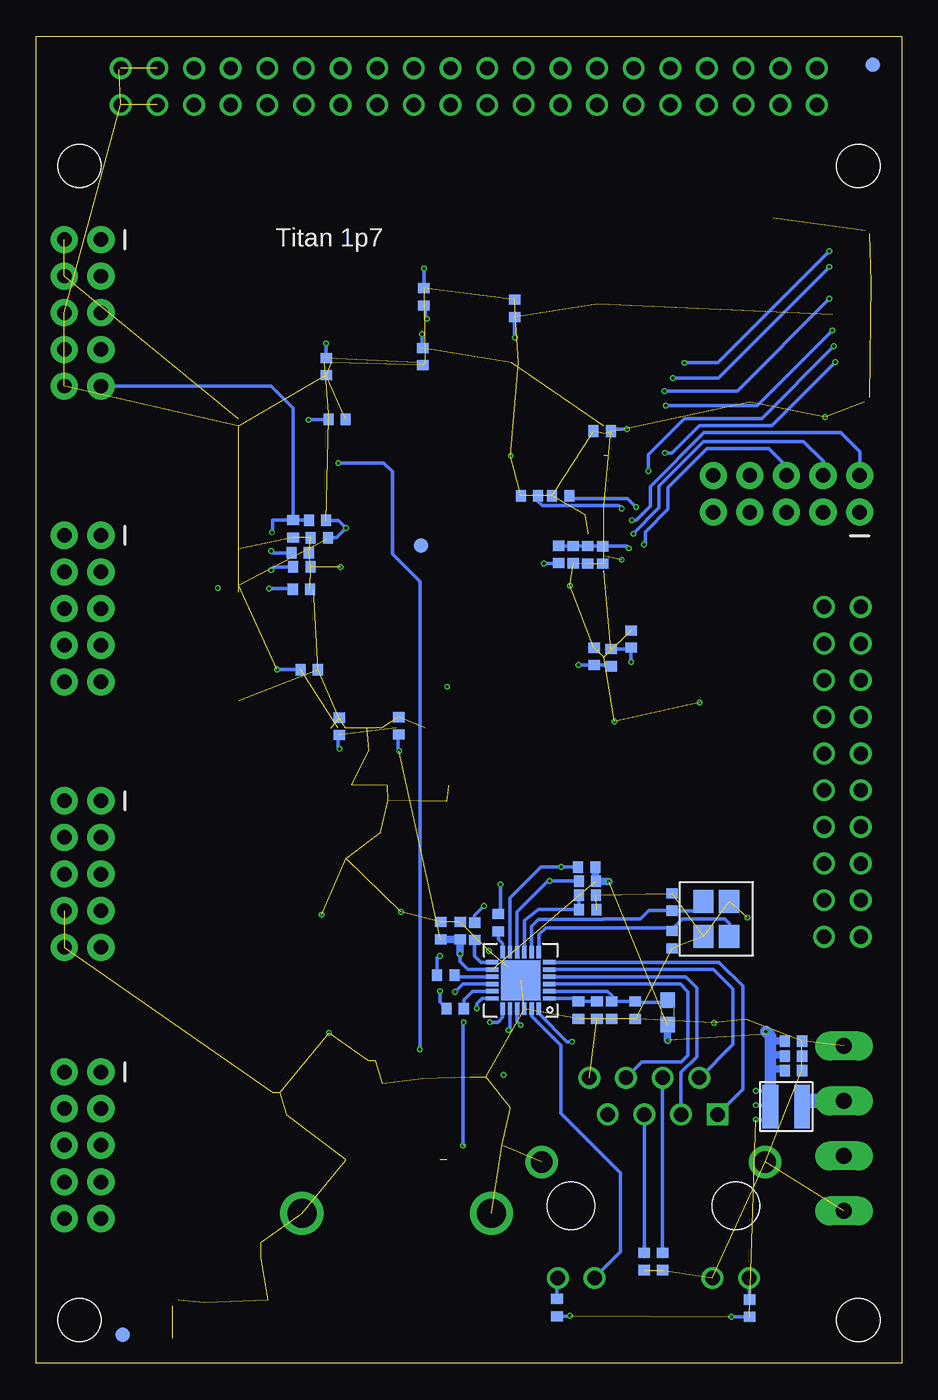
[diagram p10: board, bottom side, seen from below]

Size 60 x 92 mm. Coordinates in mm from the lower left corner, seen from the top.
Outline: 0,0 60,0 60,92 0,92 0,0
Copper layers ([3:[2:[15:1+2*3+14*15+16:2]:15]]): Top 0.0348mm / dielectric 0.1mm / GND 0.0348mm / dielectric 0.546mm / Route3 0.0348mm / dielectric 0.1mm / Route14 0.0348mm / dielectric 0.546mm / VDD 0.0348mm / dielectric 0.1mm / Bottom 0.0348mm
Design rules "default *": minimum track width 6mil, minimum drill 0.2mm, track to track 6mil, track to pad 6mil, pad to pad 6mil, via to via 6mil, smd to smd 6mil, copper to edge 40mil, drill to drill 6mil, minimum pad ring 10mil, minimum via ring 4mil, stop-mask expansion 4mil, vias tented up to drill 0mil, thermal gap 10mil
Holes 3 mm at 3,83 57,83 57,3 3,3

### Footprints (pad centres in the part's own frame; a part is rotated, then mirrored left to right if it is on the bottom)
FIDUCIAL_1MM = smd 1 x 1: 1 0,0
0402 = smd 0.8 x 0.7: P$1 0,0.6; P$2 0,-0.6
C1210 = smd 1.6 x 2.7: 1 -1.4,0; 2 1.4,0
0603 = smd 1.1 x 1: 1 -0.85,0; 2 0.85,0
SD_CARD = smd 0.7 x 1.75: 1 3.2,-5.285; 2 2.1,-5.285; 3 1,-5.285; 4 -0.1,-5.285; 5 -1.2,-5.285; 6 -2.3,-5.285; 7 -3.4,-5.285; 8 -4.5,-5.285 | smd 1 x 1.55: 9 5.575,5.515 | smd 1.45 x 1: 10 -5.625,3.94 | smd 1.5 x 1.5: S1 5.65,-5.16 | smd 1.3 x 1.5: S2 -5.7,-5.16 | smd 0.8 x 1.4: S3 5.975,3.09 | smd 0.8 x 1.5: S4 -5.95,2.44
1X4_3.81MM_PITCH = drill 1.1 pad 2 long: P$1 0,0; P$2 3.81,0; P$3 7.62,0; P$4 11.43,0
2X5 = drill 1 pad 1.88: 1 0,0; 2 0,2.54; 3 2.54,0; 4 2.54,2.54; 5 5.08,0; 6 5.08,2.54; 7 7.62,0; 8 7.62,2.54; 9 10.16,0; 10 10.16,2.54
2_X_10_.1_INCH = drill 1: P$1 -11.43,-1.27; P$2 -11.43,1.27; P$3 -8.89,-1.27; P$4 -8.89,1.27; P$5 -6.35,-1.27; P$6 -6.35,1.27; P$7 -3.81,-1.27; P$8 -3.81,1.27; P$9 -1.27,-1.27; P$10 -1.27,1.27; P$11 1.27,-1.27; P$12 1.27,1.27; P$13 3.81,-1.27; P$14 3.81,1.27; P$15 6.35,-1.27; P$16 6.35,1.27; P$17 8.89,-1.27; P$18 8.89,1.27; P$19 11.43,-1.27; P$20 11.43,1.27
USB_A_SMT = smd 4 x 0.9: D+ 6.7,-1; D- 6.7,1; GND 6.7,-3.5; VBUS 6.7,3.5 | drill 2: SHLD1 3,-6.566; SHLD2 3,6.566
USB_MICRO-B = smd 0.4 x 2: P$1 -1.3,2.475; P$2 -0.65,2.475; P$3 0,2.475; P$4 0.65,2.475; P$5 1.3,2.475 | smd 2.1 x 1.6: P$6 -3.1,2.675; P$7 3.1,2.675 | smd 1.9 x 1.8: P$8 -3.525,0; P$9 3.525,0
HEADER_2_X_20_.1_INCH = drill 1: P$1 -24.13,-1.27; P$2 -24.13,1.27; P$3 -21.59,-1.27; P$4 -21.59,1.27; P$5 -19.05,-1.27; P$6 -19.05,1.27; P$7 -16.51,-1.27; P$8 -16.51,1.27; P$9 -13.97,-1.27; P$10 -13.97,1.27; P$11 -11.43,-1.27; P$12 -11.43,1.27; P$13 -8.89,-1.27; P$14 -8.89,1.27; P$15 -6.35,-1.27; P$16 -6.35,1.27; P$17 -3.81,-1.27; P$18 -3.81,1.27; P$19 -1.27,-1.27; P$20 -1.27,1.27; P$21 1.27,-1.27; P$22 1.27,1.27; P$23 3.81,-1.27; P$24 3.81,1.27; P$25 6.35,-1.27; P$26 6.35,1.27; P$27 8.89,-1.27; P$28 8.89,1.27; P$29 11.43,-1.27; P$30 11.43,1.27; P$31 13.97,-1.27; P$32 13.97,1.27; P$33 16.51,-1.27; P$34 16.51,1.27; P$35 19.05,-1.27; P$36 19.05,1.27; P$37 21.59,-1.27; P$38 21.59,1.27; P$39 24.13,-1.27; P$40 24.13,1.27
1008 = smd 3 x 1.1: 1 0,1.1; 2 0,-1.1
0805 = smd 1.3 x 1.5: 1 -0.95,0; 2 0.95,0
RJ45_TH_ELEC = drill 1 square: 1 -4.45,-2.54 | drill 1: 2 -3.18,0; 3 -1.91,-2.54; 4 -0.635,0; 5 0.635,-2.54; 6 1.91,0; 7 3.17,-2.54; 8 4.445,0; 9 -6.63,-13.88; 10 -4.09,-13.88; 11 4.09,-13.88; 12 6.63,-13.88 | drill 1.5: 13 -7.75,-5.84; 14 7.75,-5.84 | hole 3.299: 5.715,-8.89; -5.715,-8.89
QFN-24-M = smd 0.864 x 0.305: 1 -1.968,1.25; 2 -1.968,0.75; 3 -1.968,0.25; 4 -1.968,-0.25; 5 -1.968,-0.75; 6 -1.968,-1.25; 13 1.968,-1.25; 14 1.968,-0.75; 15 1.968,-0.25; 16 1.968,0.25; 17 1.968,0.75; 18 1.968,1.25 | smd 0.305 x 0.864: 7 -1.25,-1.968; 8 -0.75,-1.968; 9 -0.25,-1.968; 10 0.25,-1.968; 11 0.75,-1.968; 12 1.25,-1.968; 19 1.25,1.968; 20 0.75,1.968; 21 0.25,1.968; 22 -0.25,1.968; 23 -0.75,1.968; 24 -1.25,1.968 | smd 2.743 x 2.743: 25 0,0
SOT-23-5 = smd 1.626 x 0.61: 1 -1.245,0.95; 2 -1.245,0; 3 -1.245,-0.95; 4 1.245,-0.95; 5 1.245,0.95
LQFP176_24X24 = smd 1.372 x 0.254: 1 -12.675,10.75; 2 -12.675,10.25; 3 -12.675,9.75; 4 -12.675,9.25; 5 -12.675,8.75; 6 -12.675,8.25; 7 -12.675,7.75; 8 -12.675,7.25; 9 -12.675,6.75; 10 -12.675,6.25; 11 -12.675,5.75; 12 -12.675,5.25; 13 -12.675,4.75; 14 -12.675,4.25; 15 -12.675,3.75; 16 -12.675,3.25; 17 -12.675,2.75; 18 -12.675,2.25; 19 -12.675,1.75; 20 -12.675,1.25; 21 -12.675,0.75; 22 -12.675,0.25; 23 -12.675,-0.25; 24 -12.675,-0.75; 25 -12.675,-1.25; 26 -12.675,-1.75; 27 -12.675,-2.25; 28 -12.675,-2.75; 29 -12.675,-3.25; 30 -12.675,-3.75; 31 -12.675,-4.25; 32 -12.675,-4.75; 33 -12.675,-5.25; 34 -12.675,-5.75; 35 -12.675,-6.25; 36 -12.675,-6.75; 37 -12.675,-7.25; 38 -12.675,-7.75; 39 -12.675,-8.25; 40 -12.675,-8.75; 41 -12.675,-9.25; 42 -12.675,-9.75; 43 -12.675,-10.25; 44 -12.675,-10.75; 89 12.675,-10.75; 90 12.675,-10.25; 91 12.675,-9.75; 92 12.675,-9.25; 93 12.675,-8.75; 94 12.675,-8.25; 95 12.675,-7.75; 96 12.675,-7.25; 97 12.675,-6.75; 98 12.675,-6.25; 99 12.675,-5.75; 100 12.675,-5.25; 101 12.675,-4.75; 102 12.675,-4.25; 103 12.675,-3.75; 104 12.675,-3.25; 105 12.675,-2.75; 106 12.675,-2.25; 107 12.675,-1.75; 108 12.675,-1.25; 109 12.675,-0.75; 110 12.675,-0.25; 111 12.675,0.25; 112 12.675,0.75; 113 12.675,1.25; 114 12.675,1.75; 115 12.675,2.25; 116 12.675,2.75; 117 12.675,3.25; 118 12.675,3.75; 119 12.675,4.25; 120 12.675,4.75; 121 12.675,5.25; 122 12.675,5.75; 123 12.675,6.25; 124 12.675,6.75; 125 12.675,7.25; 126 12.675,7.75; 127 12.675,8.25; 128 12.675,8.75; 129 12.675,9.25; 130 12.675,9.75; 131 12.675,10.25; 132 12.675,10.75 | smd 0.254 x 1.372: 45 -10.75,-12.675; 46 -10.25,-12.675; 47 -9.75,-12.675; 48 -9.25,-12.675; 49 -8.75,-12.675; 50 -8.25,-12.675; 51 -7.75,-12.675; 52 -7.25,-12.675; 53 -6.75,-12.675; 54 -6.25,-12.675; 55 -5.75,-12.675; 56 -5.25,-12.675; 57 -4.75,-12.675; 58 -4.25,-12.675; 59 -3.75,-12.675; 60 -3.25,-12.675; 61 -2.75,-12.675; 62 -2.25,-12.675; 63 -1.75,-12.675; 64 -1.25,-12.675; 65 -0.75,-12.675; 66 -0.25,-12.675; 67 0.25,-12.675; 68 0.75,-12.675; 69 1.25,-12.675; 70 1.75,-12.675; 71 2.25,-12.675; 72 2.75,-12.675; 73 3.25,-12.675; 74 3.75,-12.675; 75 4.25,-12.675; 76 4.75,-12.675; 77 5.25,-12.675; 78 5.75,-12.675; 79 6.25,-12.675; 80 6.75,-12.675; 81 7.25,-12.675; 82 7.75,-12.675; 83 8.25,-12.675; 84 8.75,-12.675; 85 9.25,-12.675; 86 9.75,-12.675; 87 10.25,-12.675; 88 10.75,-12.675; 133 10.75,12.675; 134 10.25,12.675; 135 9.75,12.675; 136 9.25,12.675; 137 8.75,12.675; 138 8.25,12.675; 139 7.75,12.675; 140 7.25,12.675; 141 6.75,12.675; 142 6.25,12.675; 143 5.75,12.675; 144 5.25,12.675; 145 4.75,12.675; 146 4.25,12.675; 147 3.75,12.675; 148 3.25,12.675; 149 2.75,12.675; 150 2.25,12.675; 151 1.75,12.675; 152 1.25,12.675; 153 0.75,12.675; 154 0.25,12.675; 155 -0.25,12.675; 156 -0.75,12.675; 157 -1.25,12.675; 158 -1.75,12.675; 159 -2.25,12.675; 160 -2.75,12.675; 161 -3.25,12.675; 162 -3.75,12.675; 163 -4.25,12.675; 164 -4.75,12.675; 165 -5.25,12.675; 166 -5.75,12.675; 167 -6.25,12.675; 168 -6.75,12.675; 169 -7.25,12.675; 170 -7.75,12.675; 171 -8.25,12.675; 172 -8.75,12.675; 173 -9.25,12.675; 174 -9.75,12.675; 175 -10.25,12.675; 176 -10.75,12.675
DRL5 = smd 1.219 x 0.305: 1 -0.8,0.5; 2 -0.8,0; 3 -0.8,-0.5; 4 0.8,-0.5; 5 0.8,0.5
SMD_3225 = smd 1.6 x 1.4: 1 -1.2,-0.9; 2 1.2,-0.9; 3 1.2,0.9; 4 -1.2,0.9
SMD_X_2_PADS = smd 1.9 x 1.1: P$1 0,1.25; P$2 0,-1.25

### Placement (x,y rotation side)
AFID1  54,2 0 top
AFID2  2,90 0 top
AFID3  33.3,56.7 0 top
AFID4  54,2 0 bottom
AFID5  2,90 0 bottom
AFID6  33.3,56.7 0 bottom
C1  15.91,31.98 180 bottom
C2  15.91,29.37 0 bottom
C3  21.76,31.46 90 bottom
C4  7.5,22.35 90 bottom
C5  7.5,21.3 90 bottom
C6  21.31,49 180 bottom
C7  7.5,20.3 90 bottom
C8  18.46,24.48 0 bottom
C9  20.09,24.48 0 bottom
C10  22.4,24.48 0 bottom
C11  21.12,24.48 0 bottom
C12  16.56,7.07 0 bottom
C13  17.84,7.07 0 bottom
C14  31.95,30 180 bottom
C15  30.6,30 180 bottom
C16  42.18,57.85 0 bottom
C17  36.2,39.03 270 top
C18  38.13,39.5 180 top
C19  25.8,60.15 90 bottom
C20  20.76,64.62 90 bottom
C21  22.75,56.06 180 bottom
C22  21.75,56.05 180 bottom
C23  29.9,20.45 0 top
C24  23.62,60.14 90 bottom
C25  20.73,56.04 180 bottom
C26  28.8,20.45 0 top
C27  18.75,50.21 0 bottom
C28  45,8.4 270 top
C29  28.3,15.1 270 top
C30  26.83,73.12 0 bottom
C31  28.5,17.7 180 top
C32  32.14,38.97 270 top
C33  32.02,40.07 270 top
C34  33.11,73.92 0 bottom
C35  33.2,69.78 180 bottom
C36  34.86,44.19 180 bottom
C37  35.03,40.07 90 top
C38  39.89,69.09 180 bottom
C39  38.99,44.15 180 bottom
C40  40.36,57.24 270 bottom
C41  39.14,65.44 90 bottom
C42  41.6,53.65 90 bottom
C43  41.06,48.09 270 bottom
FB1  16.22,24.33 90 bottom
J1  7.41,72.6 270 top
J2  4,22 270 top
J3  55.5,77.9 270 top
J4  4.1,41 270 top
J5  2.9,59 0 top
J6  35,7.4 90 top
J7  47,1.75 0 top
J8  30,88.5 0 top
J9  55.5,20.2 270 top
J11  55.5,39 270 top
J12  55.5,57.4 270 top
L1  8,17.8 270 bottom
LED1  10.8,24.8 270 top
R1  21.78,32.46 270 bottom
R2  23.76,56.07 180 bottom
R3  20.14,48.92 180 bottom
R4  21.83,34.41 90 bottom
R5  8.12,24.09 0 top
R6  21.78,33.44 90 bottom
R7  23.89,3.88 0 bottom
R8  10.54,3.83 0 bottom
R9  27.95,30.55 0 bottom
R10  29.6,29.95 0 bottom
R11  30.95,24.6 90 bottom
R12  31.6,26.9 90 bottom
R13  40.48,58.42 90 bottom
R14  20.62,75.5 270 top
R15  21.68,73.43 90 top
R16  45.6,10.4 0 top
R17  46.7,10.4 0 top
R18  47.7,10.4 0 top
R19  31.6,21.2 270 top
R20  33.6,22.7 270 top
R21  45,7.3 90 top
R22  36.31,42.5 270 top
R23  41.58,55.22 270 bottom
R24  41.69,56.18 270 bottom
RJ1  17.2,19.8 0 top
U1  26.4,26.55 180 bottom
U2  33.2,18.5 270 top
U3  33.3,56.7 90 top
U4  36.5,20.2 270 top
U5  43.1,18 270 top
X1  12.85,30.81 270 bottom
X2  37.31,35.89 0 top
X3  32.1,37.26 90 top

### Tracks (layer width: path | path; a pad name or v marks a point on that pad's centre or on a via)
C58
  Bottom 0.254: RJ1.4 16.57,7.4 C12.P$1
C60
  Bottom 0.254: RJ1.5 17.84,7.4 C13.P$1
CRS_DV
  Bottom 0.254: U1.15 30.9,26.8 R12.P$2
D+
  Top 0.406: R18.P$2 47.7,9.07 47,8.27 J7.P$3
D-
  Top 0.406: R17.P$2 46.7,8.8 46.35,8.45 J7.P$2
ESTOP  (via drill 0.2 layers 1-3)
  Top 0.254: U3.69 45.25,57.95 v43.8,59.4
  Route3 0.254: v43.8,59.4 45.1,58.1 45.1,50.82 46.42,49.51 46.42,22.98 49.2,20.2 J9.1
ETH  (via drill 0.2)
  Top 0.254: v30.95,25.75 28.15,25.75 26.55,27.35 U3.9
  Bottom 0.254: U1.16 30.4,26.3 v30.95,25.75
ETH_CRS_DV  (via drill 0.2)
  Top 0.254: v32,28.25 32,31.4 28.55,34.85 U3.13
  Bottom 0.254: v32,28.25 32.05,28.25 32.2,28.1 R12.P$1
ETH_IRQ14  (via drill 0.2, 0.2 layers 1-14, 0.2 layers 3-16)
  Top 0.254: U3.159 18.7,54.45 v18.54,54.61
  Route14 0.254: v18.54,54.61 23.96,54.61 v24.8,55.45 26.3,53.95 26.3,29.5 29.45,26.35 v29.45,24.6
  Bottom 0.254: U1.18 29.1,25.3 29.45,24.95 v29.45,24.6 | v24.8,55.45 23.78,55.45 R2.P$1
ETH_MDC  (via drill 0.2)
  Top 0.254: U3.4 24.05,34.86 v23.6,34.41
  Bottom 0.254: U1.11 27.15,32.25 24.99,34.41 v23.6,34.41 R4.P$1
ETH_MDIO  (via drill 0.2)
  Top 0.254: U3.5 24.55,33.6 v24.39,33.44
  Bottom 0.254: U1.10 26.65,31.3 24.51,33.44 v24.39,33.44 R6.P$1
ETH_RESET  (via drill 0.2, 0.2 layers 1-14, 0.2 layers 14-16)
  Top 0.254: U3.172 17.86,47.95 v17.7,48.11
  Route14 0.254: v17.7,48.11 17.86,47.95 21.95,47.95 v22.4,48.4 22.4,22.75 v22.85,22.3
  Bottom 0.254: U1.24 25.15,24.25 23.2,22.3 v22.85,22.3 | R3.P$1 20.22,48.4 C6.P$1 v22.4,48.4
ETH_RX_ER  (via drill 0.2)
  Top 0.254: v32,25.8 31.26,26.54 31.26,31.47 28.05,34.68 U3.12
  Bottom 0.254: R11.P$1 32,25.05 v32,25.8
ETH_RXD0  (via drill 0.2)
  Top 0.254: v28.95,31.7 27.85,31.7 27.05,32.5 U3.10
  Bottom 0.254: v28.95,31.7 29.6,31.05 R10.P$1
ETH_RXD1  (via drill 0.2)
  Top 0.254: U3.11 27.55,33.58 27.8,33.25 v27.8,33.2
  Bottom 0.254: R9.P$1 27.8,31.3 v27.8,33.2
ETH_TXD0  (via drill 0.2)
  Top 0.254: v27.25,23.1 27.25,26 26.05,27.2 U3.8
  Bottom 0.254: U1.20 27.15,23.2 v27.25,23.1
ETH_TXD1  (via drill 0.2)
  Top 0.254: v26.4,23.45 26.4,26.05 25.55,26.9 U3.7
  Bottom 0.254: U1.21 26.65,23.7 v26.4,23.45
ETH_TXD_EN  (via drill 0.2)
  Top 0.254: v28.55,23.65 28.55,23.45 27.5,22.4 26.42,22.4 25.61,23.21 25.61,25.94 25.05,26.5 U3.6
  Bottom 0.254: U1.19 27.65,23.98 27.98,23.65 v28.55,23.65
GND  (via drill 0.2, 0.2 layers 1-2)  (121 unrouted)
  Top 0.254: 2.58,66.62 J1.S1 2.3,66.9 | 2.5,78.55 J1.S2 | U3.153 21.69,57.45 v21.72,57.48 | U3.150 21.75,58.95 v21.9,58.8
  Top 0.508: J1.S2 1.39,79.16 v1.39,79.42 | J1.6 v3.9,74.9 | J1.S4 9.75,78.55 v8.9,79.4
  Top 0.813: 50.52,4 J7.P$7
  Top 1.016: J7.P$8 43.48,4.42 J7.P$6
  Route3 0.152: 54.25,89.65 J8.P$40
  Bottom 0.254: v33.1,75.9 C34.P$1 | C42.P$2 40.75,53.65 | R23.P$1 40.96,55.2
  Bottom 0.508: 27.3,27.5 27.3,27.45 U1.25
  other vias: 19.4,55.7 13,23.6 34.7,31.3 40.2,31.1 14,45.8 19.9,44.5 5.3,65.6 23,53.9 27.1,62.9 39.7,22.9 28.6,28.6 10.7,30.9 38.9,55.2
IIC_1_SCL
  Top 0.254: U3.132 22.55,69.95 20.02,72.48 R14.P$2
IIC_1_SDA
  Top 0.254: U3.131 23.05,70.95 22.29,71.72 R15.P$2
LED1/SPEED
  Bottom 0.254: U1.23 25.65,24.1 23.6,22.05 23.6,17.33 19.49,13.22 19.49,7.72 RJ1.11
LS_01
  Top 0.254: J9.10 58.04,9.84 55.7,7.5 53.4,7.5 48.5,12.4 48.5,47.9 47.95,48.45 U3.50
LS_02
  Top 0.254: U3.51 48.25,48.95 49,48.2 49,13.7 52.66,10.04 J9.9
LS_03
  Top 0.254: U3.53 49.45,49.95 49.9,49.5 49.9,14.3 52.9,11.3 56.9,11.3 58.04,12.44 J9.8
LS_04
  Top 0.254: J9.7 53.02,12.58 50.41,15.19 50.41,49.67 49.62,50.46 45.98,50.46 U3.54
LS_05  (via drill 0.2 layers 1-3)
  Top 0.254: v40,63.4 40.05,63.35 44.38,63.35 44.98,63.95 U3.81
  Route3 0.254: v40,63.4 40.7,62.7 40.7,51.9 44.7,47.9 44.7,20 50.8,13.9 56.9,13.9 58.04,15.04 J9.6
LS_06  (via drill 0.2 layers 1-3)
  Top 0.254: v40.9,64.11 44.56,64.11 44.91,64.46 U3.82
  Route3 0.254: v40.9,64.11 41.5,63.51 41.5,51.9 45.2,48.2 45.2,20.5 50.58,15.12 J9.5
LS_07  (via drill 0.2 layers 1-3)
  Top 0.254: U3.86 41.06,66.45 v41,66.51
  Route3 0.254: v41,66.51 41.1,66.51 42.1,65.51 42.1,52.17 45.61,48.67 45.61,20.99 50.24,16.36 56.74,16.36 J9.4
LS_08  (via drill 0.2 layers 1-3)
  Top 0.254: v42.2,67.2 42.44,66.96 U3.87
  Route3 0.254: J9.3 50.14,17.66 46.01,21.79 46.01,49.34 43,52.35 43,66.4 v42.2,67.2
LS_09  (via drill 0.2 layers 1-3)
  Top 0.254: U3.92 42.55,71.95 v43.4,72.8
  Route3 0.254: v43.4,72.8 45.8,70.4 45.8,50.7 46.83,49.67 46.83,24.97 49.57,22.23 56.43,22.23 58.04,20.62 J9.2
M1_DIR
  Top 0.254: U3.136 19.35,65.95 15.8,69.5 15.8,76.88 7.1,85.58 7.1,88.54 J8.P$2
M1_ENABLE
  Top 0.254: U3.135 19.55,66.45 16.4,69.6 16.4,77.5 8.41,85.49 J8.P$3
M1_STEP  (via drill 0.2 layers 1-3)
  Top 0.254: U3.137 18.35,65.45 v18,65.8
  Route3 0.254: v18,65.8 18,73.5 5.87,85.63 J8.P$1
M2_DIR
  Top 0.254: U3.133 17,71.08 17,78.6 10.95,84.65 J8.P$5
M2_ENABLE  (via drill 0.2 layers 1-3)
  Top 0.254: U3.130 23.55,71.67 22.94,72.28 v22.94,72.3
  Route3 0.254: J8.P$6 12.2,88.52 12.2,85.97 22.94,75.23 v22.94,72.3
M2_STEP  (via drill 0.2 layers 1-3)
  Top 0.254: v22.6,66.83 22.48,66.95 U3.134
  Route3 0.254: v22.6,66.83 19.2,70.23 19.2,74.9 9.6,84.5 9.6,88.58 J8.P$4
M3_DIR
  Top 0.254: U3.128 24.55,75.15 14.6,85.1 14.6,88.66 J8.P$8
M3_ENABLE
  Top 0.254: U3.127 25.05,75.45 16.03,84.47 J8.P$9
M3_STEP
  Top 0.254: U3.129 24.05,74.55 13.49,85.11 J8.P$7
M4_DIR
  Top 0.254: U3.125 26.05,75.95 18.57,83.43 J8.P$11
M4_ENABLE
  Top 0.254: U3.122 27.55,74.5 26.65,75.4 26.65,76.75 19.8,83.6 19.8,88.54 J8.P$12
M4_STEP
  Top 0.254: U3.126 25.55,75.85 17.3,84.1 17.3,88.5 J8.P$10
M5_DIR
  Top 0.254: U3.120 28.55,76.35 22.3,82.6 22.3,88.58 J8.P$14
M5_ENABLE
  Top 0.254: U3.119 29.05,77.65 23.65,83.05 J8.P$15
M5_STEP  (via drill 0.2 layers 1-3)
  Top 0.254: U3.121 28.05,67.95 v28,67.9
  Route3 0.254: v28,67.9 25.1,70.8 25.1,79 21.11,82.99 J8.P$13
M6_DIR
  Top 0.254: U3.117 30.05,77.95 26.19,81.81 J8.P$17
M6_ENABLE
  Top 0.254: U3.116 30.55,79.05 27.4,82.2 27.4,88.7 26.33,89.77 J8.P$18
M6_STEP  (via drill 0.2 layers 1-3)
  Top 0.254: U3.118 29.55,67.85 v29.6,67.8
  Route3 0.254: v29.6,67.8 29.6,76.3 24.8,81.1 24.8,88.62 J8.P$16
M7_DIR
  Top 0.254: U3.114 31.55,80.35 29.9,82 29.9,88.3 30.1,88.5 28.83,89.77 J8.P$20
M7_ENABLE
  Top 0.254: U3.113 32.05,81.55 31.27,82.33 J8.P$21
M7_STEP  (via drill 0.2 layers 1-3)
  Top 0.254: U3.115 31.05,67.95 v31,67.9
  Route3 0.254: J8.P$19 28.73,80.97 31,78.7 v31,67.9
M8_DIR
  Top 0.254: U3.108 34.55,78.65 33.81,79.39 J8.P$23
M8_ENABLE
  Top 0.254: U3.107 35.05,88.35 35.1,88.4 35.1,88.48 J8.P$24
M8_STEP  (via drill 0.2 layers 1-3)
  Top 0.254: U3.109 34.05,67.85 v34.1,67.8
  Route3 0.254: v34.1,67.8 34.1,77.7 32.6,79.2 32.6,88.44 J8.P$22
M9_DIR
  Top 0.254: U3.105 36.05,84.95 37.6,86.5 37.6,88.52 J8.P$26
M9_ENABLE
  Top 0.254: U3.104 36.55,79.15 38.89,81.49 J8.P$27
M9_STEP  (via drill 0.2 layers 1-3)
  Top 0.254: U3.106 35.55,67.85 v35.5,67.8
  Route3 0.254: v35.5,67.8 35.5,86.4 36.33,87.23 J8.P$25
M10_DIR
  Top 0.254: U3.102 37.55,79.15 41.43,83.03 J8.P$29
M10_ENABLE
  Top 0.254: U3.101 38.05,78.45 42.7,83.1 42.7,88.5 J8.P$30
M10_STEP  (via drill 0.2 layers 1-3)
  Top 0.254: U3.103 37.05,67.85 v37,67.8
  Route3 0.254: v37,67.8 37,73.5 37.7,74.2 37.7,88.58 J8.P$28
M11_DIR
  Top 0.254: U3.99 39.05,77.75 45.2,83.9 45.2,88.54 J8.P$32
M11_ENABLE
  Top 0.254: U3.96 40.55,70.42 40.56,70.43 40.56,78.06 46.51,84.01 J8.P$33
M11_STEP  (via drill 0.2 layers 1-3)
  Top 0.254: U3.100 38.55,67.85 v38.5,67.8
  Route3 0.254: v38.5,67.8 38.5,71.6 39.3,72.4 39.3,80.7 43.97,85.37 J8.P$31
M12_DIR
  Top 0.254: U3.94 41.55,77.75 49.05,85.25 J8.P$35
M12_ENABLE
  Top 0.254: U3.93 42.05,75.75 50.4,84.1 50.4,88.42 J8.P$36
M12_STEP  (via drill 0.2 layers 1-3)
  Top 0.254: U3.95 41.05,67.85 v41,67.8
  Route3 0.254: v41,67.8 41,77.1 45.2,81.3 45.2,88.46 J8.P$34
N$1  (via drill 0.2)
  Top 0.254: U3.148 19,59.95 v18.4,59.35
  Bottom 0.254: v18.4,59.35 19,59.95 22.83,59.95 C24.P$2
N$3
  Top 0.508: R5.P$1 8.12,24.89 8.98,25.75 LED1.1
N$4
  Top 0.254: C33.P$1 32.62,40.97 31.55,42.05 U3.19
N$5  (via drill 0.2)
  Top 0.254: U3.62 44.6,54.45 v43.85,53.7
  Bottom 0.254: C42.P$1 42.1,53.65 42.05,53.7 v43.85,53.7
N$6  (via drill 0.2)
  Top 0.254: U3.64 44.15,55.45 v43.7,55
  Bottom 0.254: v43.7,55 43.5,55.2 42.18,55.2 R23.P$2
N$7  (via drill 0.2)
  Top 0.254: U3.65 45.92,56 44.2,56 43.9,56.3 v43.7,56.3
  Bottom 0.254: v43.7,56.3 43.58,56.17 R24.P$2
N$8
  Top 0.254: U3.27 35.55,42.69 35.54,42.67 R22.P$2
N$9  (via drill 0.2)
  other vias: 31.5,46.9
P0_00
  Top 0.254: U3.169 16.95,49.45 13.97,52.43 J4.P$2
P0_01
  Top 0.254: J4.P$1 4.03,53.63 13.43,53.63 17.11,49.95 U3.168
P0_02
  Top 0.254: U3.167 17.35,50.45 11.3,56.5 4.75,56.5 2.9,58.35 J5.1
P0_03
  Top 0.254: U3.166 17.45,50.95 11.4,57 6.85,57 5.44,58.41 J5.3
P0_04
  Top 0.254: U3.165 17.55,51.45 11.55,57.45 9.53,57.45 J5.5
P0_05
  Top 0.254: U3.164 17.65,51.95 10.6,59 J5.7
P0_06
  Top 0.254: U3.163 20.58,52.41 17.8,52.41 15.26,54.95 15.26,56.8 J5.9
P0_07
  Top 0.254: U3.162 17.85,52.95 15.8,55 15.8,60.1 14.36,61.54 J5.10
P0_08
  Top 0.254: U3.161 17.95,53.45 16.33,55.07 16.33,60.77 13.8,63.3 10.8,63.3 10.52,63.02 J5.8
P0_09  (via drill 0.2)
  Top 0.254: v17.86,56.77 17.59,56.49 17.59,54.48 18.12,53.95 U3.160
  Bottom 0.254: v17.86,56.77 17.77,56.87 17.77,57.63 16.2,59.2 16.2,60.7 13.5,63.4 9.2,63.4 7.98,62.18 J5.6
P0_14  (via drill 0.2)
  Top 0.254: U3.152 19.5,57.95 19.05,57.5 v18.6,57.5
  Bottom 0.254: v18.6,57.5 18.62,57.5 16.81,59.31 16.81,60.81 13.72,63.9 6.8,63.9 5.44,62.54 J5.4
P0_15  (via drill 0.2)
  Top 0.254: v18.7,58.44 v18.71,58.45 U3.151
  Bottom 0.254: v18.7,58.44 18.38,58.44 17.41,59.41 17.41,60.79 13.7,64.5 4.2,64.5 2.9,63.2 J5.2
P2_01  (via drill 0.2 layers 1-3)
  Top 0.254: U3.68 44.73,57.45 43.92,58.26 41.46,58.26 v39.5,56.3
  Route3 0.254: v39.5,56.3 36.8,56.3 24,43.5 4.06,43.5 J4.P$9
P3_03  (via drill 0.2 layers 1-3)
  Top 0.254: U3.85 47.65,65.95 51.8,61.8 v51.8,61.6
  Route3 0.254: v51.8,61.6 51.8,41.2 54,39 J11.1
P3_06  (via drill 0.2 layers 1-3)
  Top 0.254: U3.80 48.95,63.45 v50.8,61.6
  Route3 0.254: v50.8,61.6 50.8,61.23 51.11,60.93 51.11,40.29 53.6,37.8 56.84,37.8 J11.2
P3_07  (via drill 0.2 layers 1-3)
  Top 0.254: U3.79 48.51,62.95 v49.83,61.63
  Route3 0.254: v49.83,61.63 50.6,60.86 50.6,37.8 53.2,35.2 56.8,35.2 58.04,36.44 J11.4
P3_09  (via drill 0.2 layers 1-3)
  Top 0.254: U3.77 48.58,61.95 v48.87,61.66
  Route3 0.254: v48.87,61.66 49.84,60.7 49.84,35.16 52.3,32.7 56.8,32.7 58.02,33.92 J11.6
P3_10
  Top 0.254: U3.76 48.15,61.45 52.2,57.4 J12.1
P3_11
  Top 0.254: U3.75 47.85,60.95 52.7,56.1 56.74,56.1 J12.2
P3_12
  Top 0.254: U3.74 47.67,60.45 53.26,54.86 J12.3
P3_15
  Top 0.254: U3.57 50,51.95 51.9,50.05 51.9,48.6 55,45.5 57.8,45.5 58.04,45.74 J12.10
P4_00
  Top 0.254: U3.1 22.55,43.25 22.3,43 11.31,43 8.3,46.01 4.03,46.01 J4.P$7
P4_01
  Top 0.254: U3.2 23.05,43.05 22.4,42.4 10.61,42.4 8.2,44.81 J4.P$8
P4_08  (via drill 0.2 layers 1-3)
  Top 0.254: U3.43 43.55,36.2 v43.35,36
  Route3 0.254: v43.35,36 42.64,35.29 11.49,35.29 5.77,29.57 J4.P$20
P4_09  (via drill 0.2 layers 1-3)
  Top 0.254: U3.42 43.05,37.11 v42.85,36.91
  Route3 0.254: v42.85,36.91 41.74,35.8 11.1,35.8 5.9,30.6 3.86,30.6 J4.P$19
P4_10  (via drill 0.2 layers 1-3)
  Top 0.254: U3.41 42.55,37.98 v42.39,37.82
  Route3 0.254: v42.39,37.82 41.07,36.5 10.16,36.5 5.77,32.11 J4.P$18
P4_11  (via drill 0.2 layers 1-3)
  Top 0.254: U3.40 42.05,38.56 v41.8,38.56
  Route3 0.254: v41.8,38.56 40.34,37.1 9.48,37.1 5.7,33.32 4.04,33.32 J4.P$17
P4_12  (via drill 0.2 layers 1-3)
  Top 0.254: v41.39,39.5 41.55,39.5 U3.39
  Route3 0.254: v41.39,39.5 39.48,37.59 8.31,37.59 J4.P$16
P4_13  (via drill 0.2 layers 1-3)
  Top 0.254: U3.38 41.05,40.69 40.86,40.5 v40.86,40.3
  Route3 0.254: v40.86,40.3 38.65,38.09 7.74,38.09 5.8,36.16 4.34,36.16 J4.P$15
P4_14  (via drill 0.2 layers 1-3)
  Top 0.254: v40.09,40.99 40.55,41.45 U3.37
  Route3 0.254: v40.09,40.99 37.6,38.5 6.68,38.5 J4.P$14
P4_15  (via drill 0.2 layers 1-3)
  Top 0.254: U3.36 40.05,42.18 v39.76,41.89
  Route3 0.254: v39.76,41.89 36.9,39.03 6.43,39.03 5.7,38.3 3.94,38.3 J4.P$13
P5_11
  Top 0.254: J4.P$6 5.47,47.25 14.3,47.25 15.6,45.95 U3.176
P5_12
  Top 0.254: U3.175 20.59,46.48 16.02,46.48 13.85,48.65 4.13,48.65 J4.P$5
P5_13
  Top 0.254: U3.174 16.64,46.95 13.7,49.89 J4.P$4
P7_06  (via drill 0.2 layers 1-3)
  Top 0.254: U3.14 29.05,42.06 v29.21,41.9
  Route3 0.254: J4.P$10 5.74,41.9 v29.21,41.9
P7_07  (via drill 0.2 layers 1-3)
  Top 0.254: U3.15 29.55,42.49 29.86,42.17 29.86,41.42 v29.22,40.78
  Route3 0.254: v29.22,40.78 28.94,41.06 4.16,41.06 J4.P$11
P8_05
  Top 0.254: U3.173 17.15,47.45 13.5,51.1 4.04,51.1 J4.P$3
P9_00
  Top 0.254: U3.58 50.07,52.45 55.28,47.24 J12.9
P9_01
  Top 0.254: U3.59 50.15,52.95 54.54,48.56 56.96,48.56 58.04,49.64 J12.8
P9_05
  Top 0.254: U3.73 45.98,59.96 47.59,59.96 53.95,53.6 56.8,53.6 58.04,54.84 J12.4
P9_06
  Top 0.254: U3.72 47.33,59.45 54.45,52.32 J12.5
P9_07
  Top 0.254: U3.71 46.95,58.95 54.8,51.1 56.82,51.1 J12.6
P9_08
  Top 0.254: U3.70 46.75,58.45 55.42,49.78 J12.7
PB_00  (via drill 0.2 layers 1-3)
  Top 0.254: v29.31,39.69 30.3,40.68 30.3,42.58 30.05,42.83 U3.16
  Route3 0.254: v29.31,39.69 6.19,39.69 6.12,39.73 J4.P$12
R51
  Bottom 0.254: R7.P$1 23.89,5.86 RJ1.12
R52
  Bottom 0.254: RJ1.9 10.54,5.89 R8.P$1
RELAY_01
  Top 0.254: U3.56 45.98,51.46 49.92,51.46 51.4,49.98 51.4,38.3 53.24,36.46 J11.3
RELAY_02
  Top 0.254: U3.55 49.75,50.95 50.9,49.8 50.9,35.3 52.28,33.92 J11.5
RELAY_03  (via drill 0.2 layers 1-3)
  Top 0.254: U3.52 48.92,49.45 v49.08,49.29
  Route3 0.254: v49.08,49.29 49.1,49.27 49.1,33.2 50.92,31.38 J11.7
RELAY_04  (via drill 0.2 layers 1-3)
  Top 0.254: U3.49 47.52,47.95 v47.68,47.79
  Route3 0.254: v47.68,47.79 47.68,30.12 48.9,28.9 55.44,28.9 J11.9
RESET  (via drill 0.2)
  Top 0.254: U3.67 44.3,56.95 v43.65,57.6
  Bottom 0.254: J3.9 43.69,67.74 42.18,66.23 C16.P$1 | C16.P$1 43.6,58.45 43.6,57.65 v43.65,57.6 | C16.P$1 41.11,58.45 R13.P$1
REXT
  Bottom 0.254: U1.9 26.15,30.71 25.18,31.46 C3.P$1 22.38,31.48 R1.P$2
RXD0
  Bottom 0.254: R10.P$2 29.6,28.23 29.17,27.8 U1.13
RXD1
  Bottom 0.254: U1.12 27.65,29.1 27.95,29.4 R9.P$2
RXER
  Bottom 0.254: U1.17 29.75,25.8 30.35,25.2 R11.P$2
RXM
  Bottom 0.254: RJ1.6 18.01,20.9 15.25,20.9 14.8,21.35 14.8,25.75 15.35,26.3 U1.3
RXP
  Bottom 0.254: U1.4 14.95,26.8 14.19,26.04 14.19,21.26 15.29,20.16 RJ1.3
SD1_CD
  Top 0.254: U3.146 17.45,60.95 14.35,64.05 14.35,77.45 13.57,78.22 J1.10
SD1_CLK  (via drill 0.2)
  Top 0.254: v16.45,67.4 17.15,66.7 17.15,65.72 18.93,63.94 20.62,63.94 U3.140 | v5,73.8 J1.5
  Bottom 0.254: v16.45,67.4 11.4,67.4 v5,73.8
SD1_CMD  (via drill 0.2)
  Top 0.254: v16.35,66.39 16.59,66.16 16.59,65.7 18.84,63.45 U3.141 | v4.8,71.6 J1.3
  Bottom 0.254: v16.35,66.39 v16.34,66.4 10,66.4 v4.8,71.6
SD1_DAT0  (via drill 0.2)  (1 unrouted)
  Top 0.254: 20.38,62.95 20.37,62.94 | v15.85,68.3 15.55,68 15.55,66.12 18.72,62.95 U3.142 | v5,76 J1.7
  Bottom 0.254: v15.85,68.3 12.7,68.3 v5,76
SD1_DAT1  (via drill 0.2)
  Top 0.254: v15.05,69.35 15.05,66 18.6,62.45 U3.143 | v5,77.1 J1.8
  Bottom 0.254: v15.05,69.35 12.75,69.35 v5,77.1
SD1_DAT2  (via drill 0.2)
  Top 0.254: U3.144 18.47,61.95 17.31,63.11 v16.41,63.11 | v4.6,69.4 J1.1
  Bottom 0.254: v16.41,63.11 15.91,63.11 14.02,65 9,65 v4.6,69.4
SD1_DAT3  (via drill 0.2)
  Top 0.254: U3.145 17.94,61.45 v17.54,61.84 | v4.7,70.5 J1.2
  Bottom 0.254: v17.54,61.84 17.54,63 15.05,65.5 9.7,65.5 v4.7,70.5
SD1_WP
  Top 0.254: U3.147 17.25,60.45 12.93,64.78 J1.9
TCK
  Top 0.254: J3.7 49.8,70.28 46.98,67.45 U3.88
TDI
  Top 0.254: U3.91 43.05,71.05 49.9,77.9 J3.1
TDO
  Top 0.254: U3.90 43.54,69.38 43.54,70.68 48.23,75.36 J3.3
TMS
  Top 0.254: U3.89 44.05,70.28 46.59,72.82 J3.5
TXM
  Bottom 0.254: U1.5 13.05,27.3 11.7,25.95 11.7,22.1 14,19.8 RJ1.2
TXP
  Bottom 0.254: U1.6 12.65,27.8 11,26.15 11,19.01 RJ1.1
USB_N  (via drill 0.2 layers 1-14)
  Top 0.254: v43.7,20.7 43,20.7 42.6,20.3 U5.3 41.9,18.1 41.9,16.1 46.7,11.3 R17.P$1 | U3.46 43.95,46.45 v43.7,46.2
  Route14 0.254: v43.7,46.2 v43.7,20.7
USB_P  (via drill 0.2 layers 1-14)
  Top 0.254: v44.4,18 U5.5 43.6,16.6 47.7,12.5 R18.P$1 | U3.47 42.65,46.95 v42.5,47.1
  Route14 0.254: v42.5,47.1 43.9,47.1 44.4,46.6 v44.4,18
USB_VBUS_B
  Top 0.254: U3.44 44.05,34.9 41.4,32.25 41.4,15.2 R16.P$1
USBHS_FAULT  (via drill 0.2)
  Top 0.254: U2.3 32.2,19.8 R19.P$1 32.77,21.77 v33.4,21.77 | U3.78 39.1,62.45 v39.05,62.4
  Bottom 0.254: v33.4,21.77 33.4,54.2 35.3,56.1 35.3,61.8 35.9,62.4 v39.05,62.4
USBHS_N  (via drill 0.2 layers 1-14)
  Top 0.254: J6.D- 34,15.4 35.4,16.8 35.4,20.15 36,20.75 U4.3 v36,22.9 | U3.31 37.56,45.63 36.5,46.68 v36.5,46.7
  Route14 0.254: v36.5,46.7 36,46.2 v36,22.9
USBHS_P  (via drill 0.2 layers 1-14)
  Top 0.254: v37.8,20.2 U4.5 37,16.7 36,15.7 J6.D+ | U3.32 38.05,46.65 v38,46.7
  Route14 0.254: v38,46.7 36.9,45.6 36.9,21.1 v37.8,20.2
USBHS_VBUS  (via drill 0.2)  (2 unrouted)
  Top 0.152: v30.4,15.1 v30.41,15.11
  Top 0.254: 32,14.1 32.65,14.76 32.65,15.76 U2.5 | 28.9,15 C29.P$1 30.3,15.11 | v30.35,23.65 30.95,23.65 32.7,25.4 32.7,31.5 29,35.2 29,38.15 30.75,39.9 30.75,42.83 30.55,43.02 U3.17 | v30.4,15.1 30.5,15.1 J6.VBUS
  Top 0.508: U2.5 34.2,17.2 | C29.P$1 29.9,16.1 C31.1
  Bottom 0.254: v30.35,23.65 30.4,23.6 v30.4,15.1
USBHS_VBUSEN
  Top 0.254: R20.P$1 34.2,19.8 U2.1
VBUS
  Top 0.4: R16.P$2 C28.P$1
  Top 0.406: J7.P$1 45.7,7.2 R21.P$2 C28.P$1
VCL_F(FLASH)  (via drill 0.2)
  Top 0.254: U3.112 32.55,72.05 v32.9,72.4
  Bottom 0.254: C34.P$2 33.01,73.22 33.01,72.41 33,72.4 v32.9,72.4
VDD  (via drill 0.2, 0.2 layers 15-16, 0.25 layers 1-15)  (22 unrouted)
  Top 0.254: U3.171 18.91,48.45 v18.75,48.61 | U3.48 43.95,47.45 v43.3,48.1 | U3.84 41.15,65.45 v41.1,65.4 | v39.9,70.7 40.05,70.55 U3.97 | U3.110 33.55,71.05 v33.25,71.35 | U3.149 19.6,59.45 v19.4,59.25 | U3.155 18.95,56.45 v18.9,56.5 | U3.154 19.35,56.95 v18.9,56.5 | v18.9,56.5 18.7,56.3 18.7,55.38 19.12,54.95 U3.158 | U3.34 39.05,42.7 v38.95,42.6 | U3.138 19.25,64.95 v19.05,64.75 | v47.4,53.75 47.2,53.95 U3.61 | U3.123 27.05,70.85 v26.8,71.1 | U3.25 34.55,42.73 v34.83,42.45 35.05,42.68 U3.26 | 21.25,75.5 R14.P$1 21.2,75.48 v21.2,74.4 21.2,73.55 R15.P$1 | J1.4 v4.8,72.7
  Top 0.508: 9.4,22.81 v9.4,23 8.91,23.49 R5.P$2
  Bottom 0.152: U1.14 28.39,27.28
  Bottom 0.254: 23.92,3.05 23.93,3.31 R7.P$2 23.02,3.28 v23,3.3 | U1.14 30.05,27.3 30.6,27.85 v30.6,28.4 | v18.75,48.61 C27.P$2 18.84,49.52 R3.P$2 | v19.4,59.25 19.6,59.45 24.9,59.45 25.2,59.75 C19.P$2 | v18.9,56.5 19.04,56.64 C25.P$2 21.74,56.64 C22.P$2 C21.P$2 R2.P$2 | v19.05,64.75 20.03,64.75 C20.P$2 | v39.9,70.7 C38.P$2 | C36.P$1 34.8,43.53 | C39.P$1 39.05,43.49 39.05,42.7 v38.95,42.6 | 39.68,57.31 C40.P$1 39.16,57.23 v38.5,57.9 39.02,58.42 R13.P$2 | C35.P$2 33.25,70.43 v33.25,71.35 | v10.1,17.9 9.2,17.9 L1.2 | L1.2 9.1,17.2 9.4,16.9 v10.1,16.9 | L1.2 9.1,18.9 v10.1,18.9 | v34.83,42.45 34.9,42.52 34.9,43.55 | v43.3,48.1 43.29,48.09 C43.P$2 | C30.P$2 26.83,71.13 v26.8,71.1 | R8.P$2 v11.8,3.23 | v41.1,65.4 39.78,65.4 C41.P$1
  Bottom 0.508: v20.3,33.4 21.18,33.4 R6.P$2 21.23,33.49 R4.P$2 | C7.P$1 8.2,20.4 9.1,20.4 | C5.P$1 8.2,21.4 9.1,21.4 | C4.P$1 9.05,22.35 9.1,22.3 | 23.84,3.23 23.93,3.31 | C40.P$1 39.85,57.15 | 39.01,43.54 C39.P$1 | 34.9,43.55 C36.P$1 | C38.P$2 | C35.P$2 | C14.P$1 C15.P$1 v30.6,28.4 | FB1.1 16.22,22.42 v16.2,22.4
  Bottom 0.813: L1.2 9.1,20.4 9.1,21.4 9.1,22.3 9.1,22.7 v9.4,23
VDD5  (via drill 0.2, 0.25 layers 1-15)
  Top 0.254: C23.P$1 30.85,21.05 R19.P$2 31,21.4 32.3,22.7 R20.P$2
  Top 0.508: C23.P$1 C26.P$1 28.65,21.05 v27.6,20 | v31.33,16.7 31.7,16.7 U2.4
  VDD 0.508: J2.P$3 5.22,15.6 23.2,15.6 v27.6,20 30.9,16.7 v31.33,16.7
  pour VDD: 0.6,15.7 6.5,15.7 7.4,14.8 7.4,13 6.9,12.5 0.6,12.5
VDD_1.2
  Bottom 0.254: U1.1 22.62,25.3 C10.P$1 C11.P$1
VDD_ENET1
  Bottom 0.254: U1.2 20.39,25.8 20.09,25.5 C9.P$1 C8.P$1 18.39,25.01 16.32,25.01
  Bottom 0.508: 16.32,25.01 FB1.2
VDDIN
  Bottom 0.813: 6.82,17.88 L1.1
  Bottom 1.016: J2.P$2 6.51,18.19 6.82,17.88
XCIN
  Top 0.254: X3.P$1 31.55,37.26 32.04,37.75 32.04,38.27 C32.P$1 33.35,39.58 33.35,40.92 32.05,42.23 U3.20
XCOUT
  Top 0.254: U3.21 32.55,42.51 34.03,41.02 34.03,40.48 C37.P$1 34.43,38.34 X3.P$2
XII
  Bottom 0.254: U1.8 25.65,30.3 25.17,30.78 20.69,30.78 20.68,30.8 18.1,30.8 17.5,31.4 15.93,31.4 C1.P$1 15.88,31.35 14.41,31.35 X1.1
XOO
  Bottom 0.254: U1.7 25.15,29.72 24.67,30.2 16.14,30.2 C2.P$1 15.91,30.09 15.2,30.8 12.24,30.8 11.95,30.5 X1.3
XTAL1
  Top 0.254: X2.1 36.54,34.99 37.3,35.75 37.3,38.53 C17.P$1 36.6,39.23 36.6,40.5 35.84,41.26 34.47,41.26 33.55,42.18 U3.23
XTAL2
  Top 0.254: X2.3 38.4,36.9 38.4,38.62 38.13,38.88 C18.P$1 37.96,39.05 37.16,39.86 37.16,40.94 36.43,41.67 34.68,41.67 34.05,42.3 U3.24

### Text on the board
tNames: 2 | 40 | 1 | 39 | 1 | VDD | TDI | 2 | Titan | TDO | TMS | TCK | RESET | 9 | 10 | GND | 2 | 10 | 9 | 1 | 1 | 2 | 20 | 19 | GND | 3.3V | 5V | E
bNames: Titan 1p7